# Altium project Thermostat_8CH.PrjPCB (part 3 of 6)

## Sheet TH8_TEC_driver.SchDoc: TEC
size 420 x 297 mm; Author: G.Kasprowicz; CompanyName: WUT ISE; DrawnBy: G.Kasprowicz; Organization: WUT ISE; Address1: PW ISE; Address2: Nowowiejska 15/19 00-665 Warsaw; Address3: gkasprow@gmail.com; DocumentNumber: 4; Revision: 1.0; SheetNumber: 4; SheetTotal: 9; ModifiedBy: -; CheckedDate: -; Title2: driver; DivGrp: WUT ISE; Designer: G.Kasprowicz; ModifiedDate: -; ProjectName: Sensor Box
Used 4 times, as channels U_TEC_driver0, U_TEC_driver1, U_TEC_driver2, U_TEC_driver3. Parts and nets are listed once, with the designators drawn on the sheet.
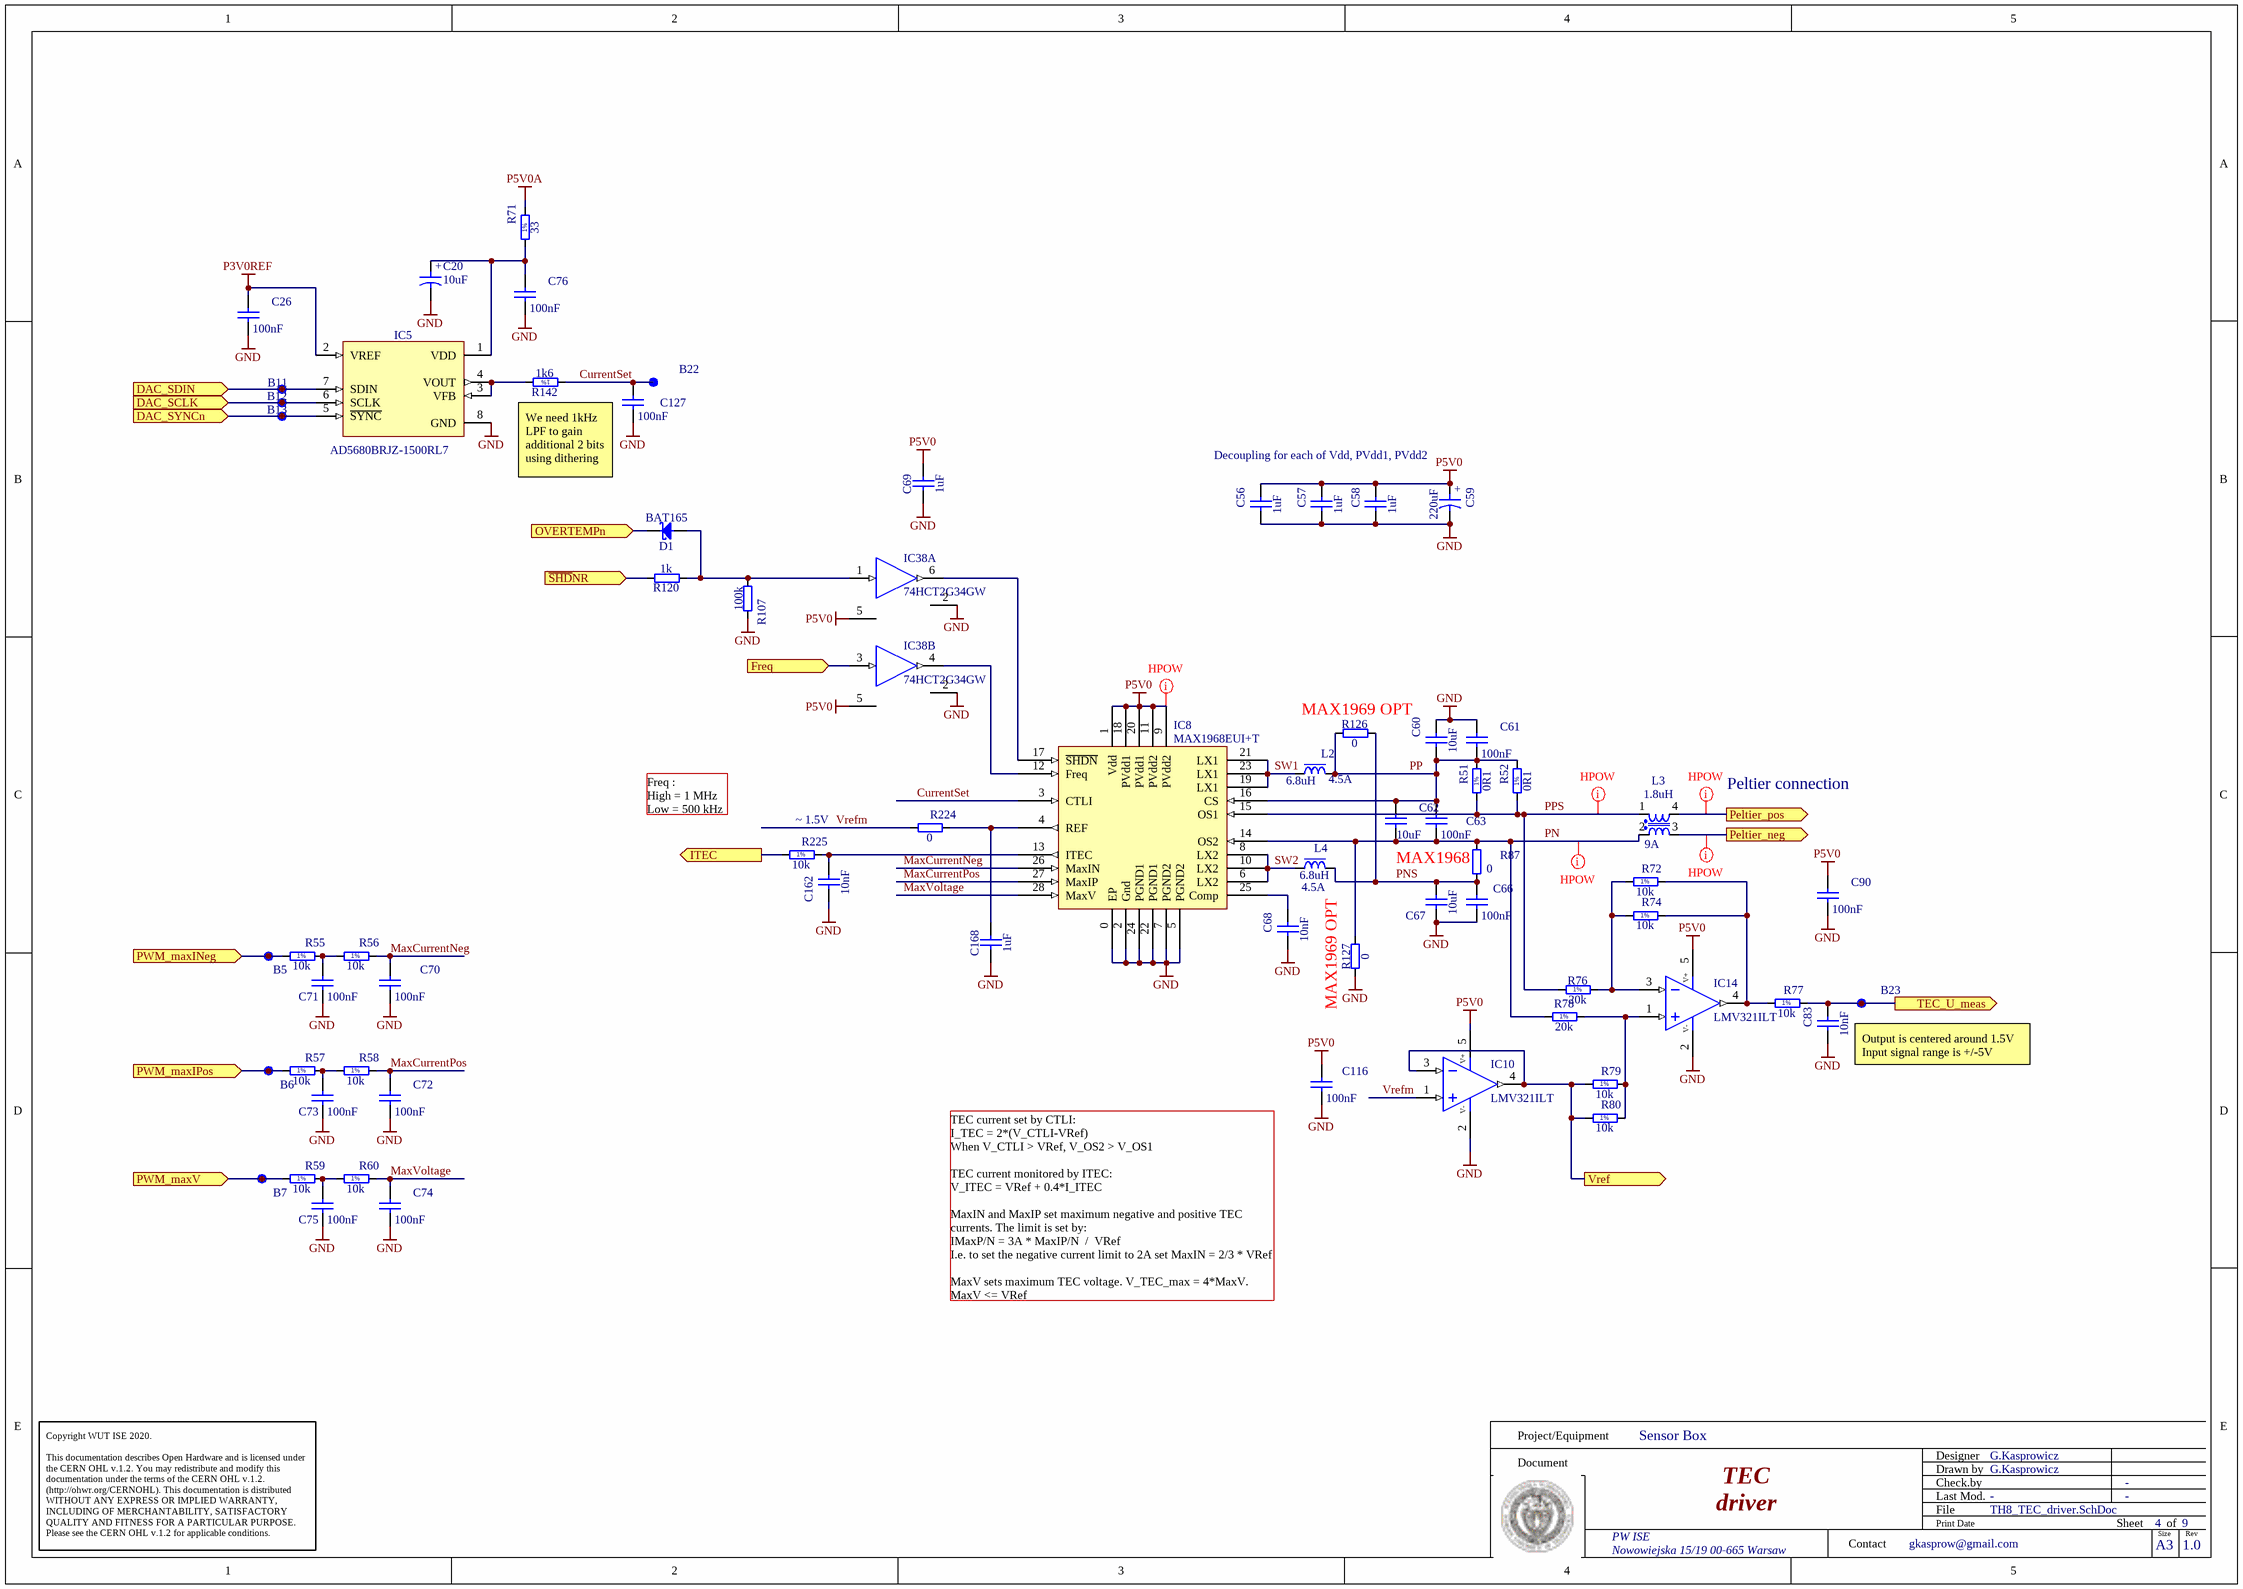
[diagram p3: TH8_TEC_driver.SchDoc]

### Parts
B5  SMD Pad  [C100]  (value not drawn)
B6  SMD Pad  [C100]  (value not drawn)
B7  SMD Pad  [C100]  (value not drawn)
B11  SMD Pad  [C100]  (value not drawn)
B12  SMD Pad  [C100]  (value not drawn)
B13  SMD Pad  [C100]  (value not drawn)
B22  SMD Pad  [C100]  (value not drawn)
B23  SMD Pad  [C100]  (value not drawn)
C20  10uF  [CAPMP3216X180N]
C26  100nF  [CAPC1005X55N]
C56  1uF  [CAPC1608X87N]
C57  1uF  [CAPC1608X87N]
C58  1uF  [CAPC1608X87N]
C59  220uF  [CAPMP7343X430N]
C60  10uF  [CAPC2012X135N]
C61  100nF  [CAPC1005X55N]
C62  10uF  [CAPC2012X135N]
C63  100nF  [CAPC1005X55N]
C66  100nF  [CAPC1005X55N]
C67  10uF  [CAPC2012X135N]
C68  10nF  [CAPC1005X55N]
C69  1uF  [CAPC1608X87N]
C70  100nF  [CAPC1005X55N]
C71  100nF  [CAPC1005X55N]
C72  100nF  [CAPC1005X55N]
C73  100nF  [CAPC1005X55N]
C74  100nF  [CAPC1005X55N]
C75  100nF  [CAPC1005X55N]
C76  100nF  [CAPC1005X55N]
C83  10nF  [CAPC1005X55N]
C90  100nF  [CAPC1005X55N]
C116  100nF  [CAPC1005X55N]
C127  100nF  [CAPC1005X55N]
C162  10nF  [CAPC1005X55N]
C168  1uF  [CAPC1608X87N]
D1  BAT165  [SOD2512X110N]
IC5  AD5680BRJZ-1500RL7  [SOT65P280X145-8N]
IC8  MAX1968EUI+T  [TSSOP28-EP]
IC10  LMV321ILT  [SOT95P280X145-5N]
IC14  LMV321ILT  [SOT95P280X145-5N]
IC38  74HCT2G34GW  [SOT65P210X110-6N]  (parts A,B of 2)
L2  6.8uH  Power: 4.5A  [INDM6965X300N]
L3  1.8uH  Power: 9A  [IND_PULSE_PA4339]
L4  6.8uH  Power: 4.5A  [INDM6965X300N]
R51  0R1  [RESC3216X65N]
R52  0R1  [RESC3216X65N]
R55  10k  [RESC1005X40N]
R56  10k  [RESC1005X40N]
R57  10k  [RESC1005X40N]
R58  10k  [RESC1005X40N]
R59  10k  [RESC1005X40N]
R60  10k  [RESC1005X40N]
R71  33  [RESC1005X40N]
R72  10k  [RESC1005X40N]
R74  10k  [RESC1005X40N]
R76  20k  [RESC1005X40N]
R77  10k  [RESC1005X40N]
R78  20k  [RESC1005X40N]
R79  10k  [RESC1005X40N]
R80  10k  [RESC1005X40N]
R87  0  [RESC3116X80N]
R107  100k  [RESC1005X40N]
R120  1k  [RESC1005X40N]
R126  0  [RESC3116X80N]
R127  0  [RESC3116X80N]
R142  1k6  [RESC1005X40N]
R224  0  [RESC1005X40N]
R225  10k  [RESC1005X40N]

### Ports
DAC_SCLK (in), DAC_SDIN (in), DAC_SYNCn (in), Freq (in), ITEC (out), OVERTEMPn (in), Peltier_neg (out), Peltier_pos (out), PWM_maxINeg (in), PWM_maxIPos (in), PWM_maxV (in), TEC_U_meas (out), Vref (out), ~{SHD}NR (in)

### Nets
GND: C20.2 C26.2 C56.1 C57.1 C58.1 C59.2 C60.2 C61.1 C66.2 C67.1 C68.1 C69.1 C70.2 C71.2 C72.2 C73.2 C74.2 C75.2 C76.2 C83.1 C90.2 C116.2 C127.2 C162.1 C168.1 IC5.8(GND) IC8.0(EP) IC8.2(Gnd) IC8.5(PGND2) IC8.7(PGND2) IC8.22(PGND1) IC8.24(PGND1) IC10.2(V-) IC14.2(V-) IC38.2(GND) R107.2 R127.1
P3V0REF: C26.1 IC5.2(VREF)
P5V0: C56.2 C57.2 C58.2 C59.1 C69.2 C90.1 C116.1 IC8.1(Vdd) IC8.9(PVdd2) IC8.11(PVdd2) IC8.18(PVdd1) IC8.20(PVdd1) IC10.5(V+) IC14.5(V+) IC38.5(VCC)
P5V0A: R71.2
~{SHD}NR: R120.2 ; port ~{SHD}NR
CurrentSet: B22.1 C127.1 IC8.3(CTLI) R142.1
DAC_SCLK: B12.1 IC5.6(SCLK) ; port DAC_SCLK
DAC_SDIN: B11.1 IC5.7(SDIN) ; port DAC_SDIN
DAC_SYNCn: B13.1 IC5.5(~{SYNC}) ; port DAC_SYNCn
Freq: IC38.3(2A) ; port Freq
ITEC: R225.1 ; port ITEC
MaxCurrentNeg: C70.1 IC8.26(MaxIN) R56.2
MaxCurrentPos: C72.1 IC8.27(MaxIP) R58.2
MaxVoltage: C74.1 IC8.28(MaxV) R60.2
OVERTEMPn: D1.1(C) ; port OVERTEMPn
Peltier_neg: L3.3 ; port Peltier_neg
Peltier_pos: L3.4 ; port Peltier_pos
PN: C62.1 C63.2 IC8.14(OS2) L3.2 R78.1 R87.2 R127.2
PNS: C66.1 C67.2 L4.2 R87.1 R126.2
PP: C60.1 C61.2 C62.2 C63.1 IC8.16(CS) L2.2 R51.2 R52.2 R126.1
PPS: IC8.15(OS1) L3.1 R51.1 R52.1 R76.1
PWM_maxINeg: B5.1 R55.1 ; port PWM_maxINeg
PWM_maxIPos: B6.1 R57.1 ; port PWM_maxIPos
PWM_maxV: B7.1 R59.1 ; port PWM_maxV
SW1: IC8.19(LX1) IC8.21(LX1) IC8.23(LX1) L2.1
SW2: IC8.6(LX2) IC8.8(LX2) IC8.10(LX2) L4.1
TEC_U_meas: B23.1 C83.2 R77.2 ; port TEC_U_meas
Vref: IC10.3(IN-) IC10.4(OUT) R79.1 R80.1 ; port Vref
Vrefm: IC10.1(IN+) R224.1
NetC20_1: C20.1 C76.1 IC5.1(VDD) R71.1
NetC68_2: C68.2 IC8.25(Comp)
NetC71_1: C71.1 R55.2 R56.1
NetC73_1: C73.1 R57.2 R58.1
NetC75_1: C75.1 R59.2 R60.1
NetC162_2: C162.2 IC8.13(ITEC) R225.2
NetC168_2: C168.2 IC8.4(REF) R224.2
NetD1_2: D1.2(A) IC38.1(1A) R107.1 R120.1
NetIC5_3: IC5.3(VFB) IC5.4(VOUT) R142.2
NetIC8_12: IC8.12(Freq) IC38.4(2Y)
NetIC8_17: IC8.17(~{SHDN}) IC38.6(1Y)
NetIC14_1: IC14.1(IN+) R78.2 R79.2 R80.2
NetIC14_3: IC14.3(IN-) R72.1 R74.1 R76.2
NetIC14_4: IC14.4(OUT) R72.2 R74.2 R77.1

### Channels
U_TEC_driver0: designators end in _1; ports DAC_SCLK=DAC_SCLK DAC_SDIN=DAC_SDIN DAC_SYNCn=DAC_SYNCn0 Freq=Freq ITEC=ITEC0 OVERTEMPn=OVERTHERMn Peltier_neg=TEC0- Peltier_pos=TEC0+ PWM_maxINeg=PWM_maxINeg0 PWM_maxIPos=PWM_maxIPos0 PWM_maxV=PWM_maxV0 TEC_U_meas=TEC_U_meas0 Vref=Vref0 ~{SHD}NR=~{SHDN}0
U_TEC_driver1: designators end in _2; ports DAC_SCLK=DAC_SCLK DAC_SDIN=DAC_SDIN DAC_SYNCn=DAC_SYNCn1 Freq=Freq ITEC=ITEC1 OVERTEMPn=OVERTHERMn Peltier_neg=TEC1- Peltier_pos=TEC1+ PWM_maxINeg=PWM_maxINeg1 PWM_maxIPos=PWM_maxIPos1 PWM_maxV=PWM_maxV1 TEC_U_meas=TEC_U_meas1 Vref=Vref1 ~{SHD}NR=~{SHDN}1
U_TEC_driver2: designators end in _3; ports DAC_SCLK=DAC_SCLK DAC_SDIN=DAC_SDIN DAC_SYNCn=DAC_SYNCn2 Freq=Freq ITEC=ITEC2 OVERTEMPn=OVERTHERMn Peltier_neg=TEC2- Peltier_pos=TEC2+ PWM_maxINeg=PWM_maxINeg2 PWM_maxIPos=PWM_maxIPos2 PWM_maxV=PWM_maxV2 TEC_U_meas=TEC_U_meas2 Vref=Vref2 ~{SHD}NR=~{SHDN}2
U_TEC_driver3: designators end in _4; ports DAC_SCLK=DAC_SCLK DAC_SDIN=DAC_SDIN DAC_SYNCn=DAC_SYNCn3 Freq=Freq ITEC=ITEC3 OVERTEMPn=OVERTHERMn Peltier_neg=TEC3- Peltier_pos=TEC3+ PWM_maxINeg=PWM_maxINeg3 PWM_maxIPos=PWM_maxIPos3 PWM_maxV=PWM_maxV3 TEC_U_meas=TEC_U_meas3 Vref=Vref3 ~{SHD}NR=~{SHDN}3

### Layout directives
net class HPOW: P5V0, PN_U_TEC_driver0, PPS_U_TEC_driver0, TEC0+, TEC0-

### Notes on the sheet
- Decoupling for each of Vdd, PVdd1, PVdd2
- We need 1kHz LPF to gain additional 2 bits using dithering
- (near R126) MAX1969 OPT
- Peltier connection
- Freq :
  High = 1 MHz
  Low = 500 kHz
- (near R225) ~ 1.5V
- MAX1968
- (near R127) MAX1969 OPT
- Output is centered around 1.5V
  Input signal range is +/-5V
- (near C116) TEC current set by CTLI:
  I_TEC = 2*(V_CTLI-VRef)
  When V_CTLI > VRef, V_OS2 > V_OS1
  TEC current monitored by ITEC:
  V_ITEC = VRef + 0.4*I_ITEC
  MaxIN and MaxIP set maximum negative and positive TEC currents. The limit is set by:
  IMaxP/N = 3A * MaxIP/N  /  VRef
  I.e. to set the negative current limit to 2A set MaxIN = 2/3 * VRef
  MaxV sets maximum TEC voltage. V_TEC_max = 4*MaxV. MaxV <= VRef
- Project/Equipment
- Document
- Designer
- Drawn by
- Check.by
- Copyright WUT ISE 2020.
  This documentation describes Open Hardware and is licensed under the CERN OHL v.1.2. You may redistribute and modify this documentation under the terms of the CERN OHL v.1.2. (http://ohwr.org/CERNOHL). This documentation is distributed WITHOUT ANY EXPRESS OR IMPLIED WARRANTY, INCLUDING OF MERCHANTABILITY, SATISFACTORY QUALITY AND FITNESS FOR A PARTICULAR PURPOSE. Please see the CERN OHL v.1.2 for applicable conditions.
- Contact
- File
- Last Mod.
- Print Date
- Sheet
- Size
- A3
- of
- Rev
- (in symbol CTE3216-18_10UF_16V_20%_AVX_TCJ) +
- (in symbol CTE7343-43_220UF_16V_10%) +
- (in symbol R0402_1K6_1%_0.0625W_100PPM) 1%
- (in symbol R0402_10K_1%_0.0625W_100PPM) 1%
- (in symbol R0402_20K_1%_0.0625W_100PPM) 1%
- (in symbol R0402_33R_1%_0.0625W_100PPM) 1%
- (in symbol R1206_0R1_1%_0.25W_100PPM_YAGEO_PT) 1%

### Library data of the parts
B5-B7 B11-B13 B22 B23 = SMD_PAD_D1MM: as B14 on sheet TH8_CPU_STM32F4; Part Number: SMD_PAD_D1MM; Component Kind: Standard (No BOM); Component Type: Standard (No BOM); Pin Count: 1; Family: SMD Pad; Socket: No; SMD: No; Sense: No; Status: None; ComponentHeight: 0mm; HelpURL: Undefined; Author: CERN DEM JLC; CreateDate: 10.10.2017; LatestRevisionDate: 10.10.2017; PackageDescription: 1mm Diameter SMD Pad
C20 = CTE3216-18_10UF_16V_20%_AVX_TCJ: Polarised capacitor; Part Description: ESR 0R200 Tantalum Solid Electrolytic Chip Capacitor with Conductive Polymer Electrode; Manufacturer: AVX; Manufacturer Part Number: TCJA106M016R0200; Voltage: 16V; Tolerance: ±20%; Part Number: CTE3216-18_10UF_16V_20%_AVX_TCJ; Component Kind: Standard; Component Type: Standard; Pin Count: 2; Value: 10uF; Status: Preferred; Case: A; Mounted: Yes; Socket: No; SMD: Yes; Sense: No; ComponentHeight: 1.8mm; HelpURL: \\cern.ch\dfs\Applications\Altium\Datasheets\CTE_AVX_TCJ.pdf; Author: CERN DEM JLC; CreateDate: 29.03.2012; LatestRevisionDate: 29.03.2012
C26 C61 C63 C66 C70-C76 C90 C116 C127 = CC0402_100NF_16V_10%_X5R: Non-polarised capacitor; Part Description: SMD Multilayer Chip Ceramic Capacitor; Manufacturer: GENERIC; Manufacturer1 Part Number: GRM155R61C104KA88D; Voltage: 16V; TC: X5R; Tolerance: ±10%; Table: Capacitors SMD; Part Number: CC0402_100NF_16V_10%_X5R; Component Kind: Standard; Component Type: Standard; Pin Count: 2; Value: 100nF; Status: None; Manufacturer Part Number: CC0402_100NF_16V_10%_X5R; Case: 0402; Mounted: Yes; Socket: No; SMD: Yes; Manufacturer1 Example: MURATA; Manufacturer1 ComponentHeight: 0.55mm; HelpURL: \\cern.ch\dfs\Applications\Altium\Datasheets\CC0402_X5R_MURATA_GRM.pdf; Author: CERN DEM JLC; CreateDate: 2013-12-10; LatestRevisionDate: 2013-12-10
C56-C58 C69 C168 = CC0603_1UF_25V_10%_X7R: Non-polarised capacitor; Part Description: SMD Multilayer Chip Ceramic Capacitor; Manufacturer: GENERIC; Manufacturer1 Part Number: GRM188R71E105KA12D; Voltage: 25V; TC: X7R; Tolerance: ±10%; Part Number: CC0603_1UF_25V_10%_X7R; Component Kind: Standard; Component Type: Standard; Pin Count: 2; Value: 1uF; Status: None; Manufacturer Part Number: CC0603_1UF_25V_10%_X7R; Case: 0603; Mounted: Yes; Socket: No; SMD: Yes; Sense: No; Manufacturer1 Example: MURATA; Manufacturer1 ComponentHeight: 0.9mm; HelpURL: \\cern.ch\dfs\Applications\Altium\Datasheets\CC0603_X7R_MURATA.pdf; Author: CERN DEM JLC; CreateDate: 18/01/2011; LatestRevisionDate: 18/01/2011
C59 = CTE7343-43_220UF_16V_10%: Polarised capacitor; Part Description: Solid Tantalum Chip Capacitor; Manufacturer: GENERIC; Manufacturer1 Part Number: TAJE227K016R; Voltage: 16V; Tolerance: ±10%; Part Number: CTE7343-43_220UF_16V_10%; Component Kind: Standard; Component Type: Standard; Pin Count: 2; Value: 220uF; Status: Preferred; Manufacturer Part Number: CTE7343-43_220UF_16V_10%; Case: E; Mounted: Yes; Socket: No; SMD: Yes; Sense: No; Manufacturer1 Example: AVX; Manufacturer1 ComponentHeight: 4.3mm; HelpURL: \\cern.ch\dfs\Applications\Altium\Datasheets\CTE_AVX_TAJ.pdf; Author: CERN DEM JLC; CreateDate: 03.12.2007; LatestRevisionDate: 03.12.2007
C60 C62 C67 = CC0805_10UF_16V_10%_X5R: Non-polarised capacitor; Part Description: SMD Multilayer Chip Ceramic Capacitor; Manufacturer: GENERIC; Manufacturer1 Part Number: C0805C106K4PAC; Voltage: 16V; TC: X5R; Tolerance: ±10%; Part Number: CC0805_10UF_16V_10%_X5R; Component Kind: Standard; Component Type: Standard; Pin Count: 2; Value: 10uF; Status: Preferred; Manufacturer Part Number: CC0805_10UF_16V_10%_X5R; Case: 0805; Mounted: Yes; Socket: No; SMD: Yes; Manufacturer1 Example: KEMET; Manufacturer1 ComponentHeight: 1.4mm; HelpURL: \\cern.ch\dfs\Applications\Altium\Datasheets\CC1206_X5R_KEMET.pdf; Author: CERN DEM JLC; CreateDate: 03.12.2007; LatestRevisionDate: 03.12.2007; Sense: No
C68 C83 C162 = CC0402_10NF_25V_10%_X7R: Non-polarised capacitor; Part Description: SMD Multilayer Chip Ceramic Capacitor; Manufacturer: GENERIC; Manufacturer1 Part Number: C1005X7R1E103KT; Voltage: 25V; TC: X7R; Tolerance: ±10%; Part Number: CC0402_10NF_25V_10%_X7R; Component Kind: Standard; Component Type: Standard; Pin Count: 2; Value: 10nF; Status: Preferred; Manufacturer Part Number: CC0402_10NF_25V_10%_X7R; Case: 0402; Mounted: Yes; Socket: No; SMD: Yes; Sense: No; Manufacturer1 Example: TDK; Manufacturer1 ComponentHeight: 0.55mm; HelpURL: \\cern.ch\dfs\Applications\Altium\Datasheets\CC0402_X7R_TDK_C.pdf; Author: CERN DEM JLC; CreateDate: 25/10/2012; LatestRevisionDate: 25/10/2012
D1 = BAT165: Schottky Diode; Part Description: Medium Power AF Schottky Diode; Manufacturer: INFINEON; Voltage: 40V; Power: 750mA; PressFit: No; Bonding: No; Part Number: BAT165; Component Kind: Standard; Component Type: Standard; Device: BAT165; PackageDescription: Small Outline Diode Flat Lead (SOD-323), 1.70mm W X 1.25mm L X 1.10mm H body,  IPC Medium Density; Manufacturer Part Number: BAT165; Pin Count: 2; Case: SOD323; Mounted: Yes; Socket: No; SMD: Yes; Sense: No; ComponentHeight: 1.1mm; HelpURL: \\cern.ch\dfs\Applications\Altium\Datasheets\BAT165.pdf; Author: CERN DEM JLC; CreateDate: 12.11.2014; LatestRevisionDate: 12.11.2014
IC5 = DAC_AD5680BRJZ: 5V 18-Bit nanoDAC®in a SOT-23; Manufacturer: ANALOG DEVICES; PressFit: No; Bonding: No; Part Number: AD5680BRJZ-1500RL7; Component Kind: Standard; Component Type: Standard; Device: AD5680BRJZ-1500RL7; Footprint: TSOP65P280X145-8N; PackageDescription: TSOP, 8-Leads, Body 2,90x1,60mm, Pitch 0,65mm, IPC Medium Density; Part Description: 5V 18-Bit nanoDAC®in a SOT-23; Manufacturer Part Number: AD5680BRJZ-1500RL7; Pin Count: 17; Case: SOT-23-8; Mounted: Yes; Socket: No; SMD: Yes; Sense: No; ComponentHeight: 0.8mm; Author: GK; HelpURL: \\cern.ch\dfs\Applications\Altium\Datasheets\AD5686BCPZ.pdf; CreateDate: 21.08.2017; LatestRevisionDate: 21.08.2017
IC8 = DRV_MAX1968: Power peltier driver. bipolar; LatestRevisionDate: 17-Jul-2002; LatestRevisionNote: Re-released for DXP Platform.; Publisher: Altium Limited; Supplier 1: RS; Supplier Part Number 1: 7328863; Supplier Currency 1: GBP; Supplier Unit Price 1: 14.75
IC10 IC14 = LMV321ILT: Operational Amplifier; Part Description: Low Cost, Low Power, Input/Output Rail-To-Rail Operational Amplifiers; Manufacturer: ST MICROELECTRONICS; PressFit: No; Bonding: No; Part Number: LMV321ILT; Component Kind: Standard; Component Type: Standard; Device: LMV321ILT; PackageDescription: SOT, 0.95mm pitch; 5 pin, 1.60mm W X 2.90mm L X 1.45mm H body, IPC Medium Density; Manufacturer Part Number: LMV321ILT; Pin Count: 5; Case: SOT23-5; Mounted: Yes; Socket: No; SMD: Yes; Sense: No; ComponentHeight: 1.45mm; Author: CERN DEM MR; HelpURL: \\cern.ch\dfs\Applications\Altium\Datasheets\LMV321ILT.pdf; CreateDate: 02.10.2017; LatestRevisionDate: 02.10.2017
IC38 = 74HCT2G34GW: Dual Buffer Gate; Manufacturer: TEXAS INSTRUMENTS; PressFit: No; Bonding: No; Part Number: 74HCT2G34GW; Component Kind: Standard; Component Type: Standard; Device: 74HCT2G34GW; PackageDescription: SOT, 0.65mm Pitch; 6 Pin, 1.60mm W X 3.00mm L X 1.45mm H body, IPC Medium Density; Part Description: Dual Buffer Gate; Manufacturer Part Number: 74HCT2G34GW; Pin Count: 6; Case: SOT353; Mounted: Yes; Socket: No; SMD: Yes; Sense: No; ComponentHeight: 1.45mm; Author: GK; HelpURL: \\cern.ch\dfs\Applications\Altium\Datasheets\SN74LVC2G34DBV.pdf; CreateDate: 09.10.2020; LatestRevisionDate: 09.10.2020
L2 L4 = IND2525_6.8UH_20%_VISHAY_IHLP-2525CZ-01: Inductor With Core; Part Description: Low Profile, High Current IHLP® Inductor; Manufacturer: VISHAY DALE; Manufacturer Part Number: IHLP2525CZER6R8M01; Resistance: 0.054R; Tolerance: ±20%; Part Number: IND2525_6.8UH_20%_VISHAY_IHLP-2525CZ-01; Component Kind: Standard; Component Type: Standard; Pin Count: 2; Value: 6.8uH; Status: None; Case: 2525; Mounted: Yes; Socket: No; SMD: Yes; Sense: No; ComponentHeight: 3mm; HelpURL: \\cern.ch\dfs\Applications\Altium\Datasheets\IND2525_VISHAY_IHLP-2525CZ-01.pdf; Author: CERN DEM MR; CreateDate: 29/06/2017; LatestRevisionDate: 29/06/2017
L3 = L_CMC_PA4339.101NLT: 1.8uH 9A 10mR CMC; Part Description: Line Filter, Common Mode Choke; Manufacturer: PULSE; Resistance: 0.010R; Tolerance: ±50%; Part Number: PA4339.101NLT; Component Kind: Standard; Component Type: Standard; Pin Count: 4; Value: 1.8uH; Status: None; Manufacturer Part Number: PA4339.101NLT; Mounted: Yes; Socket: No; SMD: Yes; Sense: No; ComponentHeight: 3.8; HelpURL: \\cern.ch\dfs\Applications\Altium\Datasheets\IND_BOURNS_SRF0504.pdf; Author: GK; CreateDate: 07/08/2017; LatestRevisionDate: 07/08/2017
R51 R52 = R1206_0R1_1%_0.25W_100PPM_YAGEO_PT: Resistor - 1%; Part Description: Current Sensor, Low TCR Chip Resistor; Manufacturer: YAGEO PHYCOMP; Manufacturer Part Number: PT1206FR-070R1L; Power: 0.25W; TC: ±100ppm/°C; PressFit: No; Part Number: R1206_0R1_1%_0.25W_100PPM_YAGEO_PT; Component Kind: Standard; Component Type: Standard; Pin Count: 2; Value: 0R1; Status: None; Tolerance: ±1%; Case: 1206; Mounted: Yes; Sense: No; Socket: No; SMD: Yes; ComponentHeight: 0.65mm; HelpURL: \\cern.ch\dfs\Applications\Altium\Datasheets\R1206_YAGEO_PT.pdf; Author: CERN DEM JMW; CreateDate: 06/07/2015; LatestRevisionDate: 06/07/2015
R55-R60 R72 R74 R77 R79 R80 R225 = R0402_10K_1%_0.0625W_100PPM: Resistor - 1%; Part Description: General Purpose Thick Film Chip Resistor; Manufacturer: GENERIC; Manufacturer1 Part Number: 232270671003L; TC: ±100ppm/°C; PressFit: No; Part Number: R0402_10K_1%_0.0625W_100PPM; Component Kind: Standard; Component Type: Standard; Pin Count: 2; Value: 10k; Status: Not Recommended; Power: 0.0625W; Tolerance: ±1%; Manufacturer Part Number: R0402_10K_1%_0.0625W_100PPM; Case: 0402; Mounted: Yes; Sense: No; Socket: No; SMD: Yes; Manufacturer1 Example: YAGEO PHYCOMP; Manufacturer1 ComponentHeight: 0.4mm; HelpURL: \\cern.ch\dfs\Applications\Altium\Datasheets\R0402_Phycomp_RC0402.pdf; Author: CERN DEM JLC; CreateDate: 03/12/2007; LatestRevisionDate: 17/10/2012
R71 = R0402_33R_1%_0.0625W_100PPM: as R70 on sheet TH8_CPU_STM32F4; Part Number: R0402_33R_1%_0.0625W_100PPM; Component Kind: Standard; Component Type: Standard; Pin Count: 2; Value: 33; Status: Not Recommended; Power: 0.0625W; Tolerance: ±1%; Manufacturer Part Number: R0402_33R_1%_0.0625W_100PPM; Case: 0402; Mounted: Yes; Sense: No; Socket: No; SMD: Yes; Manufacturer1 Example: YAGEO PHYCOMP; Manufacturer1 ComponentHeight: 0.4mm; HelpURL: \\cern.ch\dfs\Applications\Altium\Datasheets\R0402_Phycomp_RC0402.pdf; Author: CERN DEM JLC; CreateDate: 03/12/2007; LatestRevisionDate: 17/10/2012
R76 R78 = R0402_20K_1%_0.0625W_100PPM: Resistor - 1%; Part Description: General Purpose Thick Film Chip Resistor; Manufacturer: GENERIC; Manufacturer1 Part Number: 232270672003L; TC: ±100ppm/°C; PressFit: No; Part Number: R0402_20K_1%_0.0625W_100PPM; Component Kind: Standard; Component Type: Standard; Pin Count: 2; Value: 20k; Status: Not Recommended; Power: 0.0625W; Tolerance: ±1%; Manufacturer Part Number: R0402_20K_1%_0.0625W_100PPM; Case: 0402; Mounted: Yes; Sense: No; Socket: No; SMD: Yes; Manufacturer1 Example: YAGEO PHYCOMP; Manufacturer1 ComponentHeight: 0.4mm; HelpURL: \\cern.ch\dfs\Applications\Altium\Datasheets\R0402_Phycomp_RC0402.pdf; Author: CERN DEM JLC; CreateDate: 03.12.2007; LatestRevisionDate: 17.10.2012
R87 R126 R127 = R1206_0R_JUMPER_SEI_HCJ: Resistor; Part Description: 38.7A (0.0005R Max DC Resistance) Zero Ohm Jumper; Manufacturer: SEI (STACKPOLE ELECTRONICS INC.); Manufacturer Part Number: HCJ1206ZT0R00; PressFit: No; Part Number: R1206_0R_JUMPER_SEI_HCJ; Component Kind: Standard; Component Type: Standard; Pin Count: 2; Value: 0; Status: Not Recommended; Case: 1206; Mounted: Yes; Sense: No; Socket: No; SMD: Yes; HelpURL: \\cern.ch\dfs\Applications\Altium\Datasheets\R1206_SEI_HCJ.pdf; Author: CERN DEM MR; CreateDate: 20.02.2018; LatestRevisionDate: 20.02.2018; ComponentHeight: 0.8mm
R107 = R0402_100K_1%_0.0625W_100PPM: Resistor - 1%; Part Description: General Purpose Thick Film Chip Resistor; Manufacturer: GENERIC; Manufacturer1 Part Number: 232270671004L; TC: ±100ppm/°C; PressFit: No; Part Number: R0402_100K_1%_0.0625W_100PPM; Component Kind: Standard; Component Type: Standard; Pin Count: 2; Value: 100k; Status: Not Recommended; Power: 0.0625W; Tolerance: ±1%; Manufacturer Part Number: R0402_100K_1%_0.0625W_100PPM; Case: 0402; Mounted: Yes; Sense: No; Socket: No; SMD: Yes; Manufacturer1 Example: YAGEO PHYCOMP; Manufacturer1 ComponentHeight: 0.4mm; HelpURL: \\cern.ch\dfs\Applications\Altium\Datasheets\R0402_Phycomp_RC0402.pdf; Author: CERN DEM JLC; CreateDate: 03.12.2007; LatestRevisionDate: 17.10.2012
R120 = R0402_1K_1%_0.0625W_100PPM: Resistor - 1%; Part Description: General Purpose Thick Film Chip Resistor; Manufacturer: GENERIC; Manufacturer1 Part Number: 232270671002L; TC: ±100ppm/°C; PressFit: No; Part Number: R0402_1K_1%_0.0625W_100PPM; Component Kind: Standard; Component Type: Standard; Pin Count: 2; Value: 1k; Status: Not Recommended; Power: 0.0625W; Tolerance: ±1%; Manufacturer Part Number: R0402_1K_1%_0.0625W_100PPM; Case: 0402; Mounted: Yes; Sense: No; Socket: No; SMD: Yes; Manufacturer1 Example: YAGEO PHYCOMP; Manufacturer1 ComponentHeight: 0.4mm; HelpURL: \\cern.ch\dfs\Applications\Altium\Datasheets\R0402_Phycomp_RC0402.pdf; Author: CERN DEM JLC; CreateDate: 03.12.2007; LatestRevisionDate: 17.10.2012
R142 = R0402_1K6_1%_0.0625W_100PPM: Resistor - 1%; Part Description: General Purpose Thick Film Chip Resistor; Manufacturer: GENERIC; Manufacturer1 Part Number: 232270671602L; TC: ±100ppm/°C; PressFit: No; Part Number: R0402_1K6_1%_0.0625W_100PPM; Component Kind: Standard; Component Type: Standard; Pin Count: 2; Value: 1k6; Status: Not Recommended; Power: 0.0625W; Tolerance: ±1%; Manufacturer Part Number: R0402_1K6_1%_0.0625W_100PPM; Case: 0402; Mounted: Yes; Sense: No; Socket: No; SMD: Yes; Manufacturer1 Example: YAGEO PHYCOMP; Manufacturer1 ComponentHeight: 0.4mm; HelpURL: \\cern.ch\dfs\Applications\Altium\Datasheets\R0402_Phycomp_RC0402.pdf; Author: CERN DEM JLC; CreateDate: 03.12.2007; LatestRevisionDate: 17.10.2012
R224 = R0402_0R_Jumper: Resistor; Part Description: 1A (0.05R Max DC Resistance) Zero Ohm Jumper; Manufacturer: GENERIC; Manufacturer1 Part Number: 232270591001L; PressFit: No; Part Number: R0402_0R_JUMPER; Component Kind: Standard; Component Type: Standard; Pin Count: 2; Value: 0; Status: Not Recommended; Manufacturer Part Number: R0402_0R_JUMPER; Case: 0402; Mounted: Yes; Sense: No; Socket: No; SMD: Yes; Manufacturer1 Example: YAGEO PHYCOMP; Manufacturer1 ComponentHeight: 0.4mm; HelpURL: \\cern.ch\dfs\Applications\Altium\Datasheets\R0402_Phycomp_RC0402.pdf; Author: CERN DEM JLC; CreateDate: 03.12.2007; LatestRevisionDate: 17.10.2012

## Sheet TH8_RMII_Ethernet.SchDoc: Thermostat 8CH
size 420 x 297 mm; Author: G.Kasprowicz; CompanyName: WUT ISE; DrawnBy: G.Kasprowicz; Organization: WUT ISE; Address1: PW ISE; Address2: Nowowiejska 15/19 00-665 Warsaw; Address3: gkasprow@gmail.com; DocumentNumber: 8; Revision: 1.0; SheetNumber: 8; SheetTotal: 9; ModifiedBy: -; CheckedDate: -; Title2: Ethernet; DivGrp: WUT ISE; Designer: G.Kasprowicz; ModifiedDate: -; ProjectName: Sensor Box
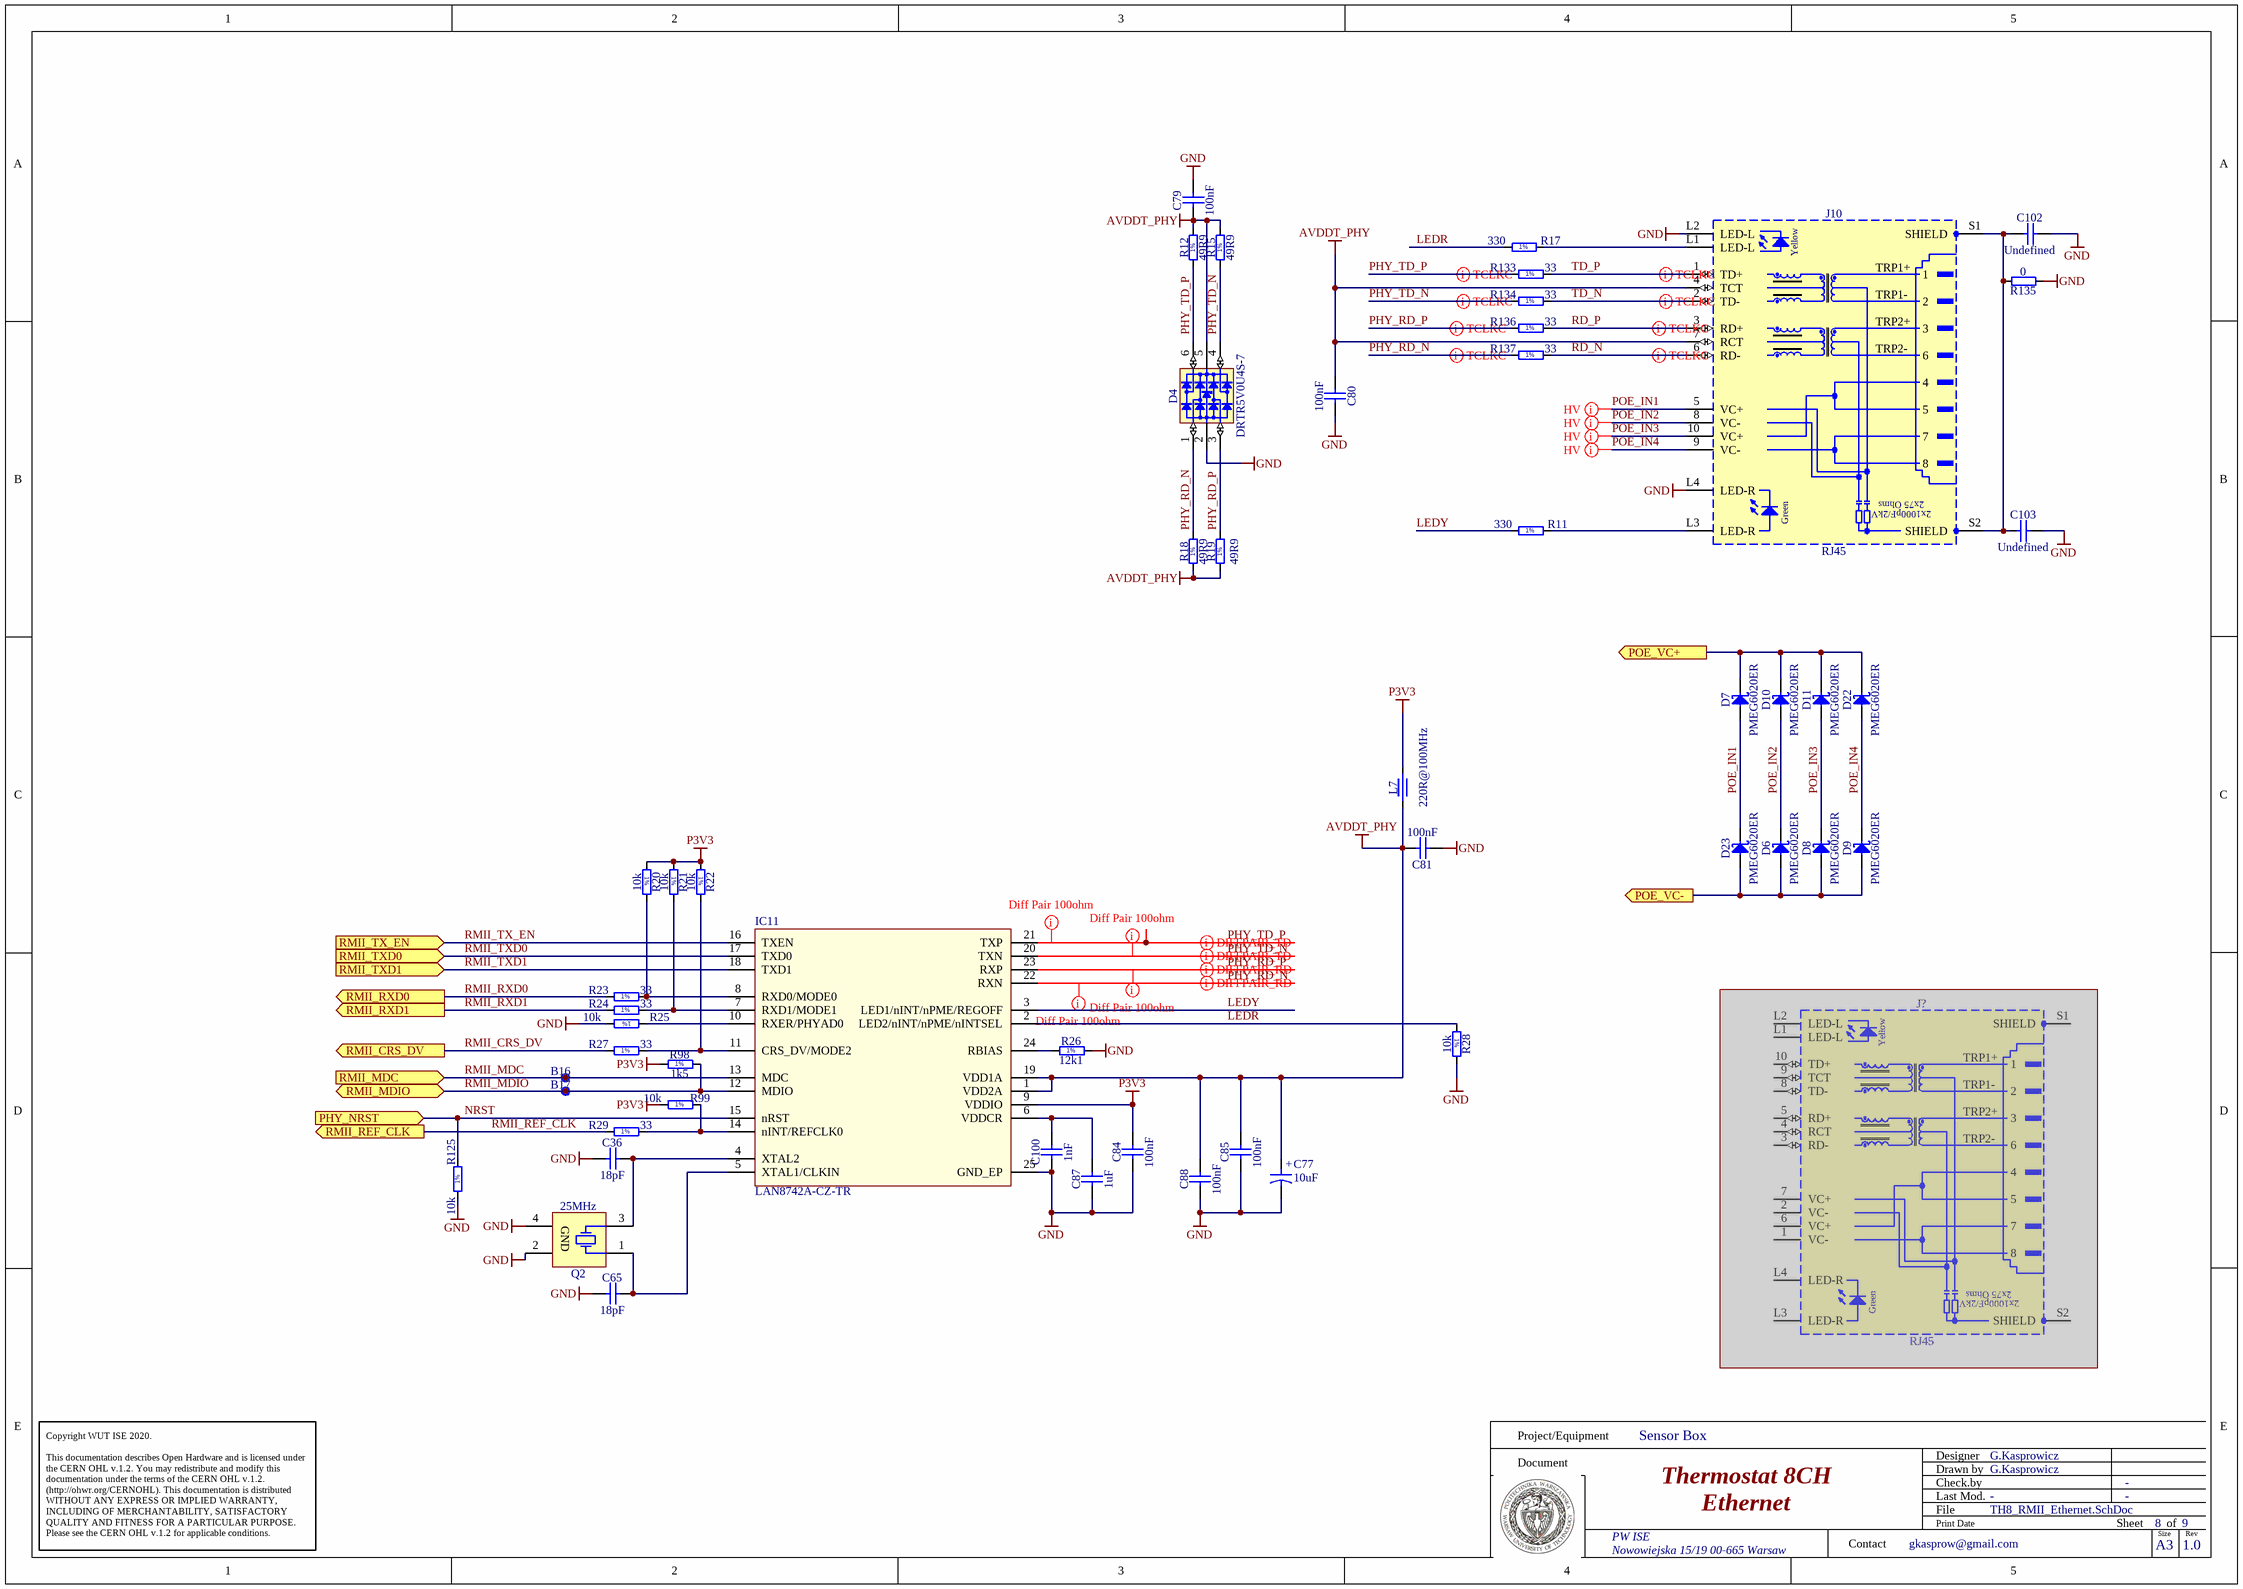
[diagram p4: TH8_RMII_Ethernet.SchDoc]

### Parts
B16  SMD Pad  [C100]  (value not drawn)
B17  SMD Pad  [C100]  (value not drawn)
C36  18pF  [CAPC1005X55N]
C65  18pF  [CAPC1005X55N]
C77  10uF  [CAPMP3216X180N]
C79  100nF  [CAPC1005X55N]
C80  100nF  [CAPC1005X55N]
C81  100nF  [CAPC1005X55N]
C84  100nF  [CAPC1005X55N]
C85  100nF  [CAPC1005X55N]
C87  1uF  [CAPC1608X87N]
C88  100nF  [CAPC1005X55N]
C100  1nF  [CAPC1005X55N]
C102  Undefined  [CAPC2012X135N]
C103  Undefined  [CAPC2012X135N]
D4  DRTR5V0U4S-7  [SOT65P210X110-6N]
D6  PMEG6020ER  [SODFL3517X110N]
D7  PMEG6020ER  [SODFL3517X110N]
D8  PMEG6020ER  [SODFL3517X110N]
D9  PMEG6020ER  [SODFL3517X110N]
D10  PMEG6020ER  [SODFL3517X110N]
D11  PMEG6020ER  [SODFL3517X110N]
D22  PMEG6020ER  [SODFL3517X110N]
D23  PMEG6020ER  [SODFL3517X110N]
IC11  LAN8742A-CZ-TR  [QFN24_0R5_4X4]
J10  RJ45  [ABRACON_ARJM11C7-114-BA-EW2]
J?  RJ45  [ABRACON_ARJM11C7-114-BA-EW2]  (masked out: inside a compile mask, not in the netlist)
L7  220R@100MHz  [INDC1005X55N]
Q2  25MHz  [XTAL_EPSON_TSX-3225]
R11  330  [RESC1005X40N]
R12  49R9  [RESC1005X40N]
R15  49R9  [RESC1005X40N]
R17  330  [RESC1005X40N]
R18  49R9  [RESC1005X40N]
R19  49R9  [RESC1005X40N]
R20  10k  [RESC1005X40N]
R21  10k  [RESC1005X40N]
R22  10k  [RESC1005X40N]
R23  33  [RESC1005X40N]
R24  33  [RESC1005X40N]
R25  10k  [RESC1005X40N]
R26  12k1  [RESC1005X40N]
R27  33  [RESC1005X40N]
R28  10k  [RESC1005X40N]
R29  33  [RESC1005X40N]
R98  1k5  [RESC1005X40N]
R99  10k  [RESC1005X40N]
R125  10k  [RESC1005X40N]
R133  33  [RESC1005X40N]
R134  33  [RESC1005X40N]
R135  0  [RESC1608X55N]
R136  33  [RESC1005X40N]
R137  33  [RESC1005X40N]

### Ports
PHY_NRST (in), POE_VC+ (out), POE_VC- (out), RMII_CRS_DV (out), RMII_MDC (in), RMII_MDIO (bidir), RMII_REF_CLK (out), RMII_RXD0 (out), RMII_RXD1 (out), RMII_TX_EN (in), RMII_TXD0 (in), RMII_TXD1 (in)

### Nets
AVDDT_PHY: C77.1 C79.1 C80.2 C81.2 C85.2 C88.2 D4.5(VBUS) IC11.1(VDD2A) IC11.19(VDD1A) J10.4(TCT) J10.7(RCT) L7.1 R12.2 R15.2 R18.1 R19.1
GND: C36.1 C65.1 C77.2 C79.2 C80.1 C81.1 C84.1 C85.1 C87.1 C88.1 C100.1 C102.2 C103.2 D4.2(GND) IC11.25(GND_EP) J10.L2(LED-L) J10.L4(LED-R) Q2.2(GND) Q2.4(GND) R25.2 R26.2 R28.2 R125.1 R135.1
P3V3: C84.2 IC11.9(VDDIO) L7.2 R20.1 R21.1 R22.1 R98.1 R99.1
LEDR: IC11.2(LED2/nINT/nPME/nINTSEL) R17.1 R28.1
LEDY: IC11.3(LED1/nINT/nPME/REGOFF) R11.1
NRST: IC11.15(nRST) R125.2 ; port PHY_NRST
PHY_RD_N: D4.1(I/O1) IC11.22(RXN) R18.2 R137.1
PHY_RD_P: D4.3(I/O2) IC11.23(RXP) R19.2 R136.1
PHY_TD_N: D4.4(I/O3) IC11.20(TXN) R15.1 R134.1
PHY_TD_P: D4.6(I/O4) IC11.21(TXP) R12.1 R133.1
POE_IN1: D7.2(A) D23.1(C) J10.5(VC+)
POE_IN2: D6.1(C) D10.2(A) J10.8(VC-)
POE_IN3: D8.1(C) D11.2(A) J10.10(VC+)
POE_IN4: D9.1(C) D22.2(A) J10.9(VC-)
POE_VC+: D7.1(C) D10.1(C) D11.1(C) D22.1(C) ; port POE_VC+
POE_VC-: D6.2(A) D8.2(A) D9.2(A) D23.2(A) ; port POE_VC-
RD_N: J10.6(RD-) R137.2
RD_P: J10.3(RD+) R136.2
RMII_CRS_DV: R27.1 ; port RMII_CRS_DV
RMII_MDC: B16.1 IC11.13(MDC) ; port RMII_MDC
RMII_MDIO: B17.1 IC11.12(MDIO) R98.2 ; port RMII_MDIO
RMII_REF_CLK: R29.1 ; port RMII_REF_CLK
RMII_RXD0: R23.1 ; port RMII_RXD0
RMII_RXD1: R24.1 ; port RMII_RXD1
RMII_TX_EN: IC11.16(TXEN) ; port RMII_TX_EN
RMII_TXD0: IC11.17(TXD0) ; port RMII_TXD0
RMII_TXD1: IC11.18(TXD1) ; port RMII_TXD1
TD_N: J10.2(TD-) R134.2
TD_P: J10.1(TD+) R133.2
NetC36_2: C36.2 IC11.4(XTAL2) Q2.3(X)
NetC65_2: C65.2 IC11.5(XTAL1/CLKIN) Q2.1(X)
NetC87_2: C87.2 C100.2 IC11.6(VDDCR)
NetC102_1: C102.1 C103.1 J10.S1(SHIELD) J10.S2(SHIELD) R135.2
NetIC11_7: IC11.7(RXD1/MODE1) R21.2 R24.2
NetIC11_8: IC11.8(RXD0/MODE0) R20.2 R23.2
NetIC11_10: IC11.10(RXER/PHYAD0) R25.1
NetIC11_11: IC11.11(CRS_DV/MODE2) R22.2 R27.2
NetIC11_14: IC11.14(nINT/REFCLK0) R29.2 R99.2
NetIC11_24: IC11.24(RBIAS) R26.1
NetJ10_L1: J10.L1(LED-L) R17.2
NetJ10_L3: J10.L3(LED-R) R11.2

### Layout directives
differential pair: PHY_RD_N, PHY_RD_P, PHY_TD_N, PHY_TD_P, RD_N, RD_P, TD_N, TD_P
rule Matched Net Lengths [Tolerance = 100mil]: PHY_RD_N, PHY_RD_P, PHY_TD_N, PHY_TD_P
net class HV: POE_IN1, POE_IN2, POE_IN3, POE_IN4

### Notes on the sheet
- Project/Equipment
- Document
- Designer
- Drawn by
- Check.by
- Copyright WUT ISE 2020.
  This documentation describes Open Hardware and is licensed under the CERN OHL v.1.2. You may redistribute and modify this documentation under the terms of the CERN OHL v.1.2. (http://ohwr.org/CERNOHL). This documentation is distributed WITHOUT ANY EXPRESS OR IMPLIED WARRANTY, INCLUDING OF MERCHANTABILITY, SATISFACTORY QUALITY AND FITNESS FOR A PARTICULAR PURPOSE. Please see the CERN OHL v.1.2 for applicable conditions.
- Contact
- File
- Last Mod.
- Print Date
- Sheet
- Size
- A3
- of
- Rev
- (in symbol CON_ETH_POE_ARJM11C7) Yellow; TRP1+; TRP1-; TRP2+; TRP2-; 2x75 Ohms; Green; 2x1000pF/2kV
- (in symbol CTE3216-18_10UF_16V_20%_AVX_TCJ) +
- (in symbol R0402_1K5_1%_0.0625W_100PPM) 1%
- (in symbol R0402_10K_1%_0.0625W_100PPM) 1%
- (in symbol R0402_12K1_1%_0.0625W_100PPM) 1%
- (in symbol R0402_33R_1%_0.0625W_100PPM) 1%
- (in symbol R0402_49R9_1%_0.0625W_100PPM) 1%
- (in symbol R0402_330R_1%_0.0625W_100PPM) 1%

### Library data of the parts
B16 B17 = SMD_PAD_D1MM: Through Hole Pad; Part Description: 1mm Diameter SMD Pad; Mounted: No; Part Number: SMD_PAD_D1MM; Component Kind: Standard (No BOM); Component Type: Standard (No BOM); Pin Count: 1; Family: SMD Pad; Socket: No; SMD: No; Sense: No; Status: None; ComponentHeight: 0mm; HelpURL: Undefined; Author: CERN DEM JLC; CreateDate: 10.10.2017; LatestRevisionDate: 10.10.2017; PackageDescription: 1mm Diameter SMD Pad
C36 C65 = CC0402_18PF_50V_5%_C0G: Non-polarised capacitor; Part Description: SMD Multilayer Chip Ceramic Capacitor; Manufacturer: GENERIC; Manufacturer1 Part Number: C0402C180J5GACTU; Voltage: 50V; TC: C0G/NP0; Tolerance: ±5%; Part Number: CC0402_18PF_50V_5%_C0G; Component Kind: Standard; Component Type: Standard; Pin Count: 2; Value: 18pF; Status: Preferred; Manufacturer Part Number: CC0402_18PF_50V_5%_C0G; Case: 0402; Mounted: Yes; Socket: No; SMD: Yes; Sense: No; Manufacturer1 Example: KEMET; Manufacturer1 ComponentHeight: 0.55mm; HelpURL: \\cern.ch\dfs\Applications\Altium\Datasheets\CC0805_C0G_KEMET_(Commercial Grade).pdf; Author: CERN DEM JLC; CreateDate: 04.10.2016; LatestRevisionDate: 04.10.2016
C77 = CTE3216-18_10UF_16V_20%_AVX_TCJ: Polarised capacitor; Part Description: ESR 0R200 Tantalum Solid Electrolytic Chip Capacitor with Conductive Polymer Electrode; Manufacturer: AVX; Manufacturer Part Number: TCJA106M016R0200; Voltage: 16V; Tolerance: ±20%; Part Number: CTE3216-18_10UF_16V_20%_AVX_TCJ; Component Kind: Standard; Component Type: Standard; Pin Count: 2; Value: 10uF; Status: Preferred; Case: A; Mounted: Yes; Socket: No; SMD: Yes; Sense: No; ComponentHeight: 1.8mm; HelpURL: \\cern.ch\dfs\Applications\Altium\Datasheets\CTE_AVX_TCJ.pdf; Author: CERN DEM JLC; CreateDate: 29.03.2012; LatestRevisionDate: 29.03.2012
C79-C81 C84 C85 C88 = CC0402_100NF_16V_10%_X5R: Non-polarised capacitor; Part Description: SMD Multilayer Chip Ceramic Capacitor; Manufacturer: GENERIC; Manufacturer1 Part Number: GRM155R61C104KA88D; Voltage: 16V; TC: X5R; Tolerance: ±10%; Part Number: CC0402_100NF_16V_10%_X5R; Component Kind: Standard; Component Type: Standard; Pin Count: 2; Value: 100nF; Status: None; Manufacturer Part Number: CC0402_100NF_16V_10%_X5R; Case: 0402; Mounted: Yes; Socket: No; SMD: Yes; Manufacturer1 Example: MURATA; Manufacturer1 ComponentHeight: 0.55mm; HelpURL: \\cern.ch\dfs\Applications\Altium\Datasheets\CC0402_X5R_MURATA_GRM.pdf; Author: CERN DEM JLC; Sense: No
  C79 C80: CreateDate: 10.12.2013; LatestRevisionDate: 10.12.2013
  C81 C84 C85 C88: CreateDate: 10/12/2013; LatestRevisionDate: 10/12/2013
C87 = CC0603_1UF_16V_10%_X7R: Non-polarised capacitor; Part Description: SMD Multilayer Chip Ceramic Capacitor; Manufacturer: GENERIC; Manufacturer1 Part Number: 223878615663; Voltage: 16V; TC: X7R; Tolerance: ±10%; Part Number: CC0603_1UF_16V_10%_X7R; Component Kind: Standard; Component Type: Standard; Pin Count: 2; Value: 1uF; Status: None; Manufacturer Part Number: CC0603_1uF_16V_10%_X7R; Case: 0603; Mounted: Yes; Socket: No; SMD: Yes; Sense: No; Manufacturer1 Example: YAGEO PHYCOMP; Manufacturer1 ComponentHeight: 0.9mm; HelpURL: \\cern.ch\dfs\Applications\Altium\Datasheets\CC0603_X7R_PHYCOMP.pdf; Author: CERN DEM JLC; CreateDate: 03/12/2007; LatestRevisionDate: 17/04/2015
C100 = CC0402_1NF_50V_10%_X7R: Non-polarised capacitor; Part Description: SMD Multilayer Chip Ceramic Capacitor; Manufacturer: GENERIC; Manufacturer1 Part Number: 223858715623; Voltage: 50V; TC: X7R; Tolerance: ±10%; Part Number: CC0402_1NF_50V_10%_X7R; Component Kind: Standard; Component Type: Standard; Pin Count: 2; Value: 1nF; Status: Not Recommended; Manufacturer Part Number: CC0402_1NF_50V_10%_X7R; Case: 0402; Mounted: Yes; Socket: No; SMD: Yes; Sense: No; Manufacturer1 Example: PHYCOMP; Manufacturer1 ComponentHeight: 0.55mm; HelpURL: \\cern.ch\dfs\Applications\Altium\Datasheets\CC0402_X7R_PHYCOMP.pdf; Author: CERN DEM JLC; CreateDate: 03/12/2007; LatestRevisionDate: 03/12/2007
C102 C103 = CC0805_NO-VALUE: Non-polarised capacitor; Part Description: Reserved Footprint For 0805(2012) Chip Ceramic Capacitor; Mounted: No; Part Number: CC0805_NO-VALUE; Component Kind: Standard; Component Type: Standard; Pin Count: 2; Value: Undefined; Status: None; Manufacturer: Undefined; Manufacturer Part Number: CC0805_NO-VALUE; Case: 0805; Socket: No; SMD: Yes; Sense: No; Manufacturer1 ComponentHeight: 1.35mm; HelpURL: Undefined; Author: CERN DEM JLC; CreateDate: 10.12.2008; LatestRevisionDate: 11.09.2013
D4 = D_TVS_DRTR5V0U4S-7: Integrated Quad Ultra-Low Capacitance ESD Protection; Part Description: Integrated Quad Ultra-Low Capacitance ESD (±8kV) Protection; Manufacturer: DIODES; PressFit: No; Bonding: No; Status Comment: Active; Part Number: DRTR5V0U4S-7; Component Kind: Standard; Component Type: Standard; Device: DRTR5V0U4S-7; PackageDescription: SOT363, SC70-6, 0.65mm Pitch; 6 Pin, 1.25mm W X 2.00mm L X 1.10mm H body, IPC Medium Density; Status: Active; Manufacturer Part Number: DRTR5V0U4S-7; Pin Count: 6; Case: SOT363; Mounted: Yes; Socket: No; SMD: Yes; Sense: No; ComponentHeight: 1.1mm; HelpURL: \\cern.ch\dfs\Applications\Altium\Datasheets\PRTR5V0U4Y.pdf; Author: GK; CreateDate: 24.01.2017; LatestRevisionDate: 14.09.2020
D6-D11 D22 D23 = PMEG6020ER: Schottky Diode; Part Description: MEGA Schottky Barrier Rectifier; Manufacturer: NXP SEMICONDUCTORS; Voltage: 60V; Power: 2A; PressFit: No; Bonding: No; Part Number: PMEG6020ER; Component Kind: Standard; Component Type: Standard; Device: PMEG6020ER; PackageDescription: SODFL Diode (SOD123W); 2.60mm W X 1.70mm L X 1.10mm H body, IPC Medium Density; Manufacturer Part Number: PMEG6020ER; Pin Count: 2; Case: SOD123; Mounted: Yes; Socket: No; SMD: Yes; Sense: No; ComponentHeight: 0.65mm; HelpURL: \\cern.ch\dfs\Applications\Altium\Datasheets\PMEG6020ER.pdf; Author: CERN DEM JMW; CreateDate: 19.06.2014; LatestRevisionDate: 19.06.2014
IC11 = IFC_LAN8742A: LAN8742A-CZ-TR - Small Footprint RMII 10/100 Ethernet, Transceiver with HP Auto-MDIX and flexPWR Technology SQFN-24; Manuf_1: MICROCHIP; Order: LAN8742A-CZ-TR; Manuf_Part_1: LAN8742A-CZ-TR; Distrib: MICROCHIP
J10 = CON_ETH_POE_ARJM11C7: MagJack 10/100BaseT, PoE+, 1X1, OG/Y, -40 to 85*C, Tab Up, RoHS; Part Number: 5-2337992-3; Part Description: 1 Port, Orange Green/Yellow LEDs, RJ45 10/100BaseT, PoE, Ethernet MagJack® Connector Module; Manufacturer: TE; PressFit: No; Component Kind: Standard; Component Type: Standard; Pin Count: 18; Family: RJ45; Mounted: Yes; Socket: No; SMD: No; Sense: No; Status: None; Manufacturer Part Number: 5-2337992-3; ComponentHeight: 13.61mm; HelpURL: \\cern.ch\dfs\Applications\Altium\Datasheets\BELFUSE_0826-1X1T-GJ-F.pdf; Author: GK; CreateDate: 05.11.2012; LatestRevisionDate: 05.11.2012
J? = CON_ETH_POE_ARJM11C7: MagJack 10/100BaseT, PoE+, 1X1, OG/Y, -40 to 85*C, Tab Up, RoHS; Part Number: ARJM11C7-114-BA-EW2; Part Description: 1 Port, Orange Green/Yellow LEDs, RJ45 10/100BaseT, PoE, Ethernet MagJack® Connector Module; Manufacturer: Abracon; PressFit: No; Component Kind: Standard; Component Type: Standard; Pin Count: 18; Family: RJ45; Mounted: Yes; Socket: No; SMD: No; Sense: No; Status: None; Manufacturer Part Number: ARJM11C7-114-BA-EW2; ComponentHeight: 13.61mm; HelpURL: \\cern.ch\dfs\Applications\Altium\Datasheets\BELFUSE_0826-1X1T-GJ-F.pdf; Author: GK; CreateDate: 05.11.2012; LatestRevisionDate: 05.11.2012
L7 = IND0402_MURATA_BLM15HB221SN1: Part Description: SMD EMIFIL Suppression Chip Ferrite Bead; Manufacturer: MURATA; Power: 250mA; Resistance: 1R; Tolerance: ±25%; Part Number: IND0402_MURATA_BLM15HB221SN1; Component Kind: Standard; Component Type: Standard; Pin Count: 2; Value: 220R@100MHz; Status: None; Manufacturer Part Number: BLM15HB221SN1; Case: 0402; Mounted: Yes; Socket: No; SMD: Yes; Sense: No; ComponentHeight: 0.55mm; HelpURL: \\cern.ch\dfs\Applications\Altium\Datasheets\IND0402_MURATA_BLM15H.pdf; Author: CERN DEM JLC; CreateDate: 23.06.2009; LatestRevisionDate: 25.10.2018
Q2 = XTAL_25MHZ_EPSON_TSX-3225 25.0000MF10Z-AC: Crystal 4 pins 1=XTAL Control 2=GND3=XTAL 4=GND; Part Description: Tolerance ±10 ppm,  Stability:± 10ppm, -20°C to 75°C, 9pF, Surface Mount Quartz Crystal, TX-3225 Series; Manufacturer: EPSON; PressFit: No; Bonding: No; Part Number: XTAL_25MHZ_EPSON_TSX-3225 25.0000MF10Z-AC; Component Kind: Standard; Component Type: Standard; PackageDescription: Crystal TSX-3225 Serie, Corner Concave; 4 pin, 2.50mm L X 3.2mm W X 0.6mm H; Value: 25MHz; Manufacturer Part Number: TSX-3225 25.0000MF10Z-AC; Pin Count: 4; Mounted: Yes; Socket: No; SMD: Yes; Sense: No; ComponentHeight: 0.6mm; HelpURL: \\cern.ch\dfs\Applications\Altium\Datasheets\XTAL_EPSON_TSX-3225.pdf; ComponentLink1URL: \\cern.ch\dfs\Applications\Altium\Datasheets\XTAL_EPSON_TSX-3225_Ordering-Informations.pdf; ComponentLink1Description: Ordering Informations; Author: CERN DEM JLC; CreateDate: 03.04.2012; LatestRevisionDate: 06.10.2016
R11 R17 = R0402_330R_1%_0.0625W_100PPM: Resistor - 1%; Part Description: General Purpose Thick Film Chip Resistor; Manufacturer: GENERIC; Manufacturer1 Part Number: 232270673301L; TC: ±100ppm/°C; PressFit: No; Part Number: R0402_330R_1%_0.0625W_100PPM; Component Kind: Standard; Component Type: Standard; Pin Count: 2; Value: 330; Status: Not Recommended; Power: 0.0625W; Tolerance: ±1%; Manufacturer Part Number: R0402_330R_1%_0.0625W_100PPM; Case: 0402; Mounted: Yes; Sense: No; Socket: No; SMD: Yes; Manufacturer1 Example: YAGEO PHYCOMP; Manufacturer1 ComponentHeight: 0.4mm; HelpURL: \\cern.ch\dfs\Applications\Altium\Datasheets\R0402_Phycomp_RC0402.pdf; Author: CERN DEM JLC; CreateDate: 03.12.2007; LatestRevisionDate: 17.10.2012
R12 R15 R18 R19 = R0402_49R9_1%_0.0625W_100PPM: Resistor - 1%; Part Description: General Purpose Thick Film Chip Resistor; Manufacturer: GENERIC; Manufacturer1 Part Number: 232270674999L or RC0402FR-0749R9L; TC: ±100ppm/°C; Table: Resistors SMD; Part Number: R0402_49R9_1%_0.0625W_100PPM; Component Kind: Standard; Component Type: Standard; Pin Count: 2; Value: 49R9; Status: Not recommended; Power: 0.0625W; Tolerance: ±1%; Manufacturer Part Number: R0402_49R9_1%_0.0625W_100PPM; Case: 0402; Mounted: Yes; Socket: No; SMD: Yes; Manufacturer1 Example: YAGEO PHYCOMP; Manufacturer1 ComponentHeight: 0.4mm; HelpURL: \\cern.ch\dfs\Applications\Altium\Datasheets\R0402_Phycomp_RC0402.pdf; Author: CERN DEM JLC; CreateDate: 2012-10-24; LatestRevisionDate: 2012-10-24
R20-R22 R25 R28 R99 R125 = R0402_10K_1%_0.0625W_100PPM: Resistor - 1%; Part Description: General Purpose Thick Film Chip Resistor; Manufacturer: GENERIC; Manufacturer1 Part Number: 232270671003L; TC: ±100ppm/°C; PressFit: No; Value: 10k; Part Number: R0402_10K_1%_0.0625W_100PPM; Component Kind: Standard; Component Type: Standard; Pin Count: 2; Status: Not Recommended; Power: 0.0625W; Tolerance: ±1%; Manufacturer Part Number: R0402_10K_1%_0.0625W_100PPM; Case: 0402; Mounted: Yes; Sense: No; Socket: No; SMD: Yes; Manufacturer1 Example: YAGEO PHYCOMP; Manufacturer1 ComponentHeight: 0.4mm; HelpURL: \\cern.ch\dfs\Applications\Altium\Datasheets\R0402_Phycomp_RC0402.pdf; Author: CERN DEM JLC; CreateDate: 03/12/2007; LatestRevisionDate: 17/10/2012
R23 R24 R27 R29 R133 R134 R136 R137 = R0402_33R_1%_0.0625W_100PPM: Resistor - 1%; Part Description: General Purpose Thick Film Chip Resistor; Manufacturer: GENERIC; Manufacturer1 Part Number: 232270673309L; TC: ±100ppm/°C; PressFit: No; Part Number: R0402_33R_1%_0.0625W_100PPM; Component Kind: Standard; Component Type: Standard; Pin Count: 2; Value: 33; Status: Not Recommended; Power: 0.0625W; Tolerance: ±1%; Manufacturer Part Number: R0402_33R_1%_0.0625W_100PPM; Case: 0402; Mounted: Yes; Sense: No; Socket: No; SMD: Yes; Manufacturer1 Example: YAGEO PHYCOMP; Manufacturer1 ComponentHeight: 0.4mm; HelpURL: \\cern.ch\dfs\Applications\Altium\Datasheets\R0402_Phycomp_RC0402.pdf; Author: CERN DEM JLC; CreateDate: 03/12/2007; LatestRevisionDate: 17/10/2012
R26 = R0402_12K1_1%_0.0625W_100PPM: Resistor - 1%; Part Description: General Purpose Thick Film Chip Resistor; Manufacturer: GENERIC; Manufacturer1 Part Number: 232270671213L or RC0402FR-0712K1L; TC: ±100ppm/°C; PressFit: No; Part Number: R0402_12K1_1%_0.0625W_100PPM; Component Kind: Standard; Component Type: Standard; Pin Count: 2; Value: 12k1; Status: Not Recommended; Power: 0.0625W; Tolerance: ±1%; Manufacturer Part Number: R0402_12K1_1%_0.0625W_100PPM; Case: 0402; Mounted: Yes; Sense: No; Socket: No; SMD: Yes; Manufacturer1 Example: YAGEO PHYCOMP; Manufacturer1 ComponentHeight: 0.4mm; HelpURL: \\cern.ch\dfs\Applications\Altium\Datasheets\R0402_Phycomp_RC0402.pdf; Author: CERN DEM JLC; CreateDate: 24/10/2012; LatestRevisionDate: 24/10/2012
R98 = R0402_1K5_1%_0.0625W_100PPM: Resistor - 1%; Part Description: General Purpose Thick Film Chip Resistor; Manufacturer: GENERIC; Manufacturer1 Part Number: 232270671502L; TC: ±100ppm/°C; PressFit: No; Part Number: R0402_1K5_1%_0.0625W_100PPM; Component Kind: Standard; Component Type: Standard; Pin Count: 2; Value: 1k5; Status: Not Recommended; Power: 0.0625W; Tolerance: ±1%; Manufacturer Part Number: R0402_1K5_1%_0.0625W_100PPM; Case: 0402; Mounted: Yes; Sense: No; Socket: No; SMD: Yes; Manufacturer1 Example: YAGEO PHYCOMP; Manufacturer1 ComponentHeight: 0.4mm; HelpURL: \\cern.ch\dfs\Applications\Altium\Datasheets\R0402_Phycomp_RC0402.pdf; Author: CERN DEM JLC; CreateDate: 03/12/2007; LatestRevisionDate: 17/10/2012
R135 = R0603_0R_JUMPER: Resistor; Part Description: 1A (0.05R Max DC Resistance) Zero Ohm Jumper; Manufacturer: GENERIC; Manufacturer1 Part Number: NRC06Z0; PressFit: No; Part Number: R0603_0R_JUMPER; Component Kind: Standard; Component Type: Standard; Pin Count: 2; Value: 0; Status: Preferred; Manufacturer Part Number: R0603_0R_JUMPER; Case: 0603; Mounted: Yes; Sense: No; Socket: No; SMD: Yes; Manufacturer1 Example: NIC COMPONENT; Manufacturer1 ComponentHeight: 0.55mm; HelpURL: \\cern.ch\dfs\Applications\Altium\Datasheets\R0603_NIC_NRC.pdf; Author: CERN DEM JLC; CreateDate: 03.12.2007; LatestRevisionDate: 13.03.2008

## Sheet TH8_USB.SchDoc: Thermostat 8CH
size 420 x 297 mm; Author: G.Kasprowicz; CompanyName: WUT ISE; DrawnBy: G.Kasprowicz; Organization: WUT ISE; Address1: PW ISE; Address2: Nowowiejska 15/19 00-665 Warsaw; Address3: gkasprow@gmail.com; DocumentNumber: 9; Revision: 1.0; SheetNumber: 9; SheetTotal: 9; ModifiedBy: -; CheckedDate: -; Title2: USB connector; DivGrp: WUT ISE; Designer: G.Kasprowicz; ModifiedDate: -; ProjectName: Sensor Box
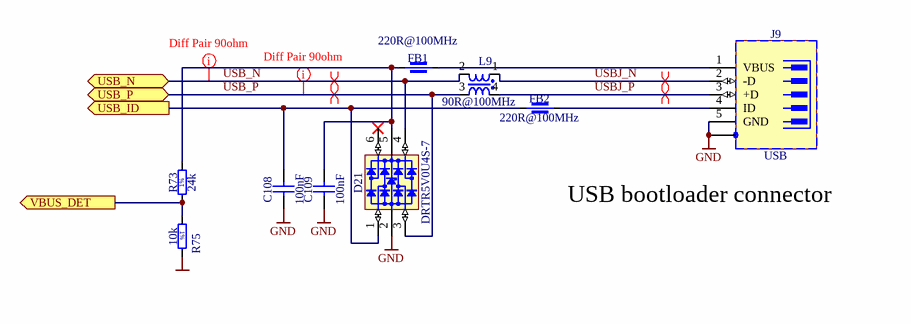
[diagram p5: TH8_USB.SchDoc]

### Parts
C108  100nF  [CAPC1005X55N]
C109  100nF  [CAPC1005X55N]
D21  DRTR5V0U4S-7  [SOT65P210X110-6N]
FB1  220R@100MHz  [INDC1005X55N]
FB2  220R@100MHz  [INDC1005X55N]
J9  USB  [UJ2-MIBH-4-MSMT]
L9  90R@100MHz  [IND_MURATA_DLW21S]
R73  24k  [RESC1608X55N]
R75  10k  [RESC1005X40N]

### Ports
USB_ID (out), USB_N (bidir), USB_P (bidir), VBUS_DET (out)

### Nets
GND: C108.1 C109.1 D21.2(GND) J9.5(GND) J9.6(SH) J9.7(SH) J9.8(SH) J9.9(SH) J9.10(SH) J9.11(SH) R75.2
USB_ID: C108.2 D21.1(I/O1) FB2.1 ; port USB_ID
USB_N: D21.4(I/O3) L9.2 ; port USB_N
USB_P: D21.3(I/O2) L9.3 ; port USB_P
USB_VBUS: R73.1 R75.1 ; port VBUS_DET
USBJ_N: J9.2(-D) L9.1
USBJ_P: J9.3(+D) L9.4
NetC109_2: C109.2 D21.5(VBUS) FB1.1 R73.2
NetFB1_2: FB1.2 J9.1(VBUS)
NetFB2_2: FB2.2 J9.4(ID)

Not connected (* = marked no-connect by the designer): D21 6(I/O4)*

### Layout directives
mark named Diff Pair 90ohm: USB_N, USB_P
differential pair: USB_N, USB_P, USBJ_N, USBJ_P

### Notes on the sheet
- (near J9) USB bootloader connector
- Project/Equipment
- Document
- Designer
- Drawn by
- Check.by
- Copyright WUT ISE 2020.
  This documentation describes Open Hardware and is licensed under the CERN OHL v.1.2. You may redistribute and modify this documentation under the terms of the CERN OHL v.1.2. (http://ohwr.org/CERNOHL). This documentation is distributed WITHOUT ANY EXPRESS OR IMPLIED WARRANTY, INCLUDING OF MERCHANTABILITY, SATISFACTORY QUALITY AND FITNESS FOR A PARTICULAR PURPOSE. Please see the CERN OHL v.1.2 for applicable conditions.
- Contact
- File
- Last Mod.
- Print Date
- Sheet
- Size
- A3
- of
- Rev
- (in symbol R0402_10K_1%_0.0625W_100PPM) 1%
- (in symbol R0603_24K_1%_0.1W_100PPM) 1%

### Library data of the parts
C108 C109 = CC0402_100NF_16V_10%_X7R: Non-polarised capacitor; Part Description: SMD Multilayer Chip Ceramic Capacitor; Manufacturer: GENERIC; Manufacturer1 Part Number: GRM155R71C104KA88D; Voltage: 16V; TC: X7R; Tolerance: ±10%; Part Number: CC0402_100NF_16V_10%_X7R; Component Kind: Standard; Component Type: Standard; Pin Count: 2; Value: 100nF; Status: Not Recommended; Manufacturer Part Number: CC0402_100NF_16V_10%_X7R; Case: 0402; Mounted: Yes; Socket: No; SMD: Yes; Manufacturer1 Example: MURATA; Manufacturer1 ComponentHeight: 0.55mm; HelpURL: \\cern.ch\dfs\Applications\Altium\Datasheets\CC0402_X7R_MURATA_GRM.pdf; Author: CERN DEM JLC; CreateDate: 05.12.2013; LatestRevisionDate: 03.12.2007; Sense: No
D21 = D_TVS_DRTR5V0U4S-7: as D4 on sheet TH8_RMII_Ethernet; Part Number: DRTR5V0U4S-7; Component Kind: Standard; Component Type: Standard; Device: DRTR5V0U4S-7; PackageDescription: SOT363, SC70-6, 0.65mm Pitch; 6 Pin, 1.25mm W X 2.00mm L X 1.10mm H body, IPC Medium Density; Status: Active; Manufacturer Part Number: DRTR5V0U4S-7; Pin Count: 6; Case: SOT363; Mounted: Yes; Socket: No; SMD: Yes; Sense: No; ComponentHeight: 1.1mm; HelpURL: \\cern.ch\dfs\Applications\Altium\Datasheets\PRTR5V0U4Y.pdf; Author: GK; CreateDate: 24.01.2017; LatestRevisionDate: 14.09.2020
FB1 FB2 = IND0402_MURATA_BLM15HB221SN1: as L7 on sheet TH8_RMII_Ethernet; Part Number: IND0402_MURATA_BLM15HB221SN1; Component Kind: Standard; Component Type: Standard; Pin Count: 2; Value: 220R@100MHz; Status: None; Manufacturer Part Number: BLM15HB221SN1; Case: 0402; Mounted: Yes; Socket: No; SMD: Yes; ComponentHeight: 0.55mm; HelpURL: \\cern.ch\dfs\Applications\Altium\Datasheets\IND0402_MURATA_BLM15H.pdf; Author: CERN DEM JLC; CreateDate: 23.06.2009; LatestRevisionDate: 25.10.2018; Sense: No
J9 = CON_USB_UJ2-MIBH-4-MSMT: 5 Pin + 1 Shield  in-line USB Receptacle; Part Number: CUI_UJ2-MIBH-4-MSMT; Part Description: 0.65mm Pitch, Micro-USB Type B Surface Mounte Vertical Receptacle; Manufacturer: CUI; PressFit: No; Component Kind: Standard; Component Type: Standard; Pin Count: 11; Family: USB; Mounted: Yes; Socket: No; SMD: Yes; Sense: No; Status: None; Manufacturer Part Number: UJ2-MIBH-4-MSMT; ComponentHeight: 1.1; HelpURL: \\cern.ch\dfs\Applications\Altium\Datasheets\MOLEX_105133-0011.pdf; Author: GK; CreateDate: 13/12/2017; LatestRevisionDate: 13/12/2017
L9 = IND_MURATA_DLW21SN900SQ2L: Inductor Common Mode; Part Description: Wire Wound Common Mode Choke Coil (DLW21S Series); Manufacturer: MURATA; Power: 330mA; Resistance: 0.35R; Tolerance: ±25%; Part Number: IND_MURATA_DLW21SN900SQ2L; Component Kind: Standard; Component Type: Standard; Pin Count: 4; Value: 90R@100MHz; Status: None; Manufacturer Part Number: DLW21SN900SQ2L; Case: 0805; Mounted: Yes; Socket: No; SMD: Yes; Sense: No; ComponentHeight: 1.4mm; HelpURL: \\cern.ch\dfs\Applications\Altium\Datasheets\IND_MURATA_DLW21S.pdf; Author: CERN DEM JLC; CreateDate: 01.07.2014; LatestRevisionDate: 01.07.2014
R73 = R0603_24K_1%_0.1W_100PPM: Resistor - 1%; Part Description: General Purpose Thick Film Chip Resistor; Manufacturer: GENERIC; Manufacturer1 Part Number: NRC06F2402TRF; Power: 0.1W; TC: ±100ppm/°C; Part Number: R0603_24K_1%_0.1W_100PPM; Component Kind: Standard; Component Type: Standard; Pin Count: 2; Value: 24k; Status: Preferred; Tolerance: ±1%; Manufacturer Part Number: R0603_24K_1%_0.1W_100PPM; Case: 0603; Mounted: Yes; Sense: No; Socket: No; SMD: Yes; Manufacturer1 Example: NIC COMPONENT; Manufacturer1 ComponentHeight: 0.55mm; HelpURL: \\cern.ch\dfs\Applications\Altium\Datasheets\R0603_NIC_NRC.pdf; Author: CERN DEM JLC; CreateDate: 03.12.2007; LatestRevisionDate: 13.03.2008
R75 = R0402_10K_1%_0.0625W_100PPM: as R20-R22 on sheet TH8_RMII_Ethernet; Part Number: R0402_10K_1%_0.0625W_100PPM; Component Kind: Standard; Component Type: Standard; Pin Count: 2; Value: 10k; Status: Not Recommended; Power: 0.0625W; Tolerance: ±1%; Manufacturer Part Number: R0402_10K_1%_0.0625W_100PPM; Case: 0402; Mounted: Yes; Sense: No; Socket: No; SMD: Yes; Manufacturer1 Example: YAGEO PHYCOMP; Manufacturer1 ComponentHeight: 0.4mm; HelpURL: \\cern.ch\dfs\Applications\Altium\Datasheets\R0402_Phycomp_RC0402.pdf; Author: CERN DEM JLC; CreateDate: 03.12.2007; LatestRevisionDate: 17.10.2012

## Sheet TH8_Supply.schdoc: Thermostat 8CH
size 420 x 297 mm; EDA_Number: ARTIQ; Projet: Thermostat; Author: G.Kasprowicz; CompanyName: WUT ISE; DrawnBy: G.Kasprowicz; Organization: WUT ISE; Address1: PW ISE; Address2: Nowowiejska 15/19 00-665 Warsaw; Address3: gkasprow@gmail.com; DocumentNumber: 5; Revision: 2.0; SheetNumber: 5; SheetTotal: 9; ModifiedBy: -; CheckedDate: -; Title2: Power supply; DivGrp: WUT ISE; Designer: G.Kasprowicz; ModifiedDate: -; ProjectName: Sensor Box
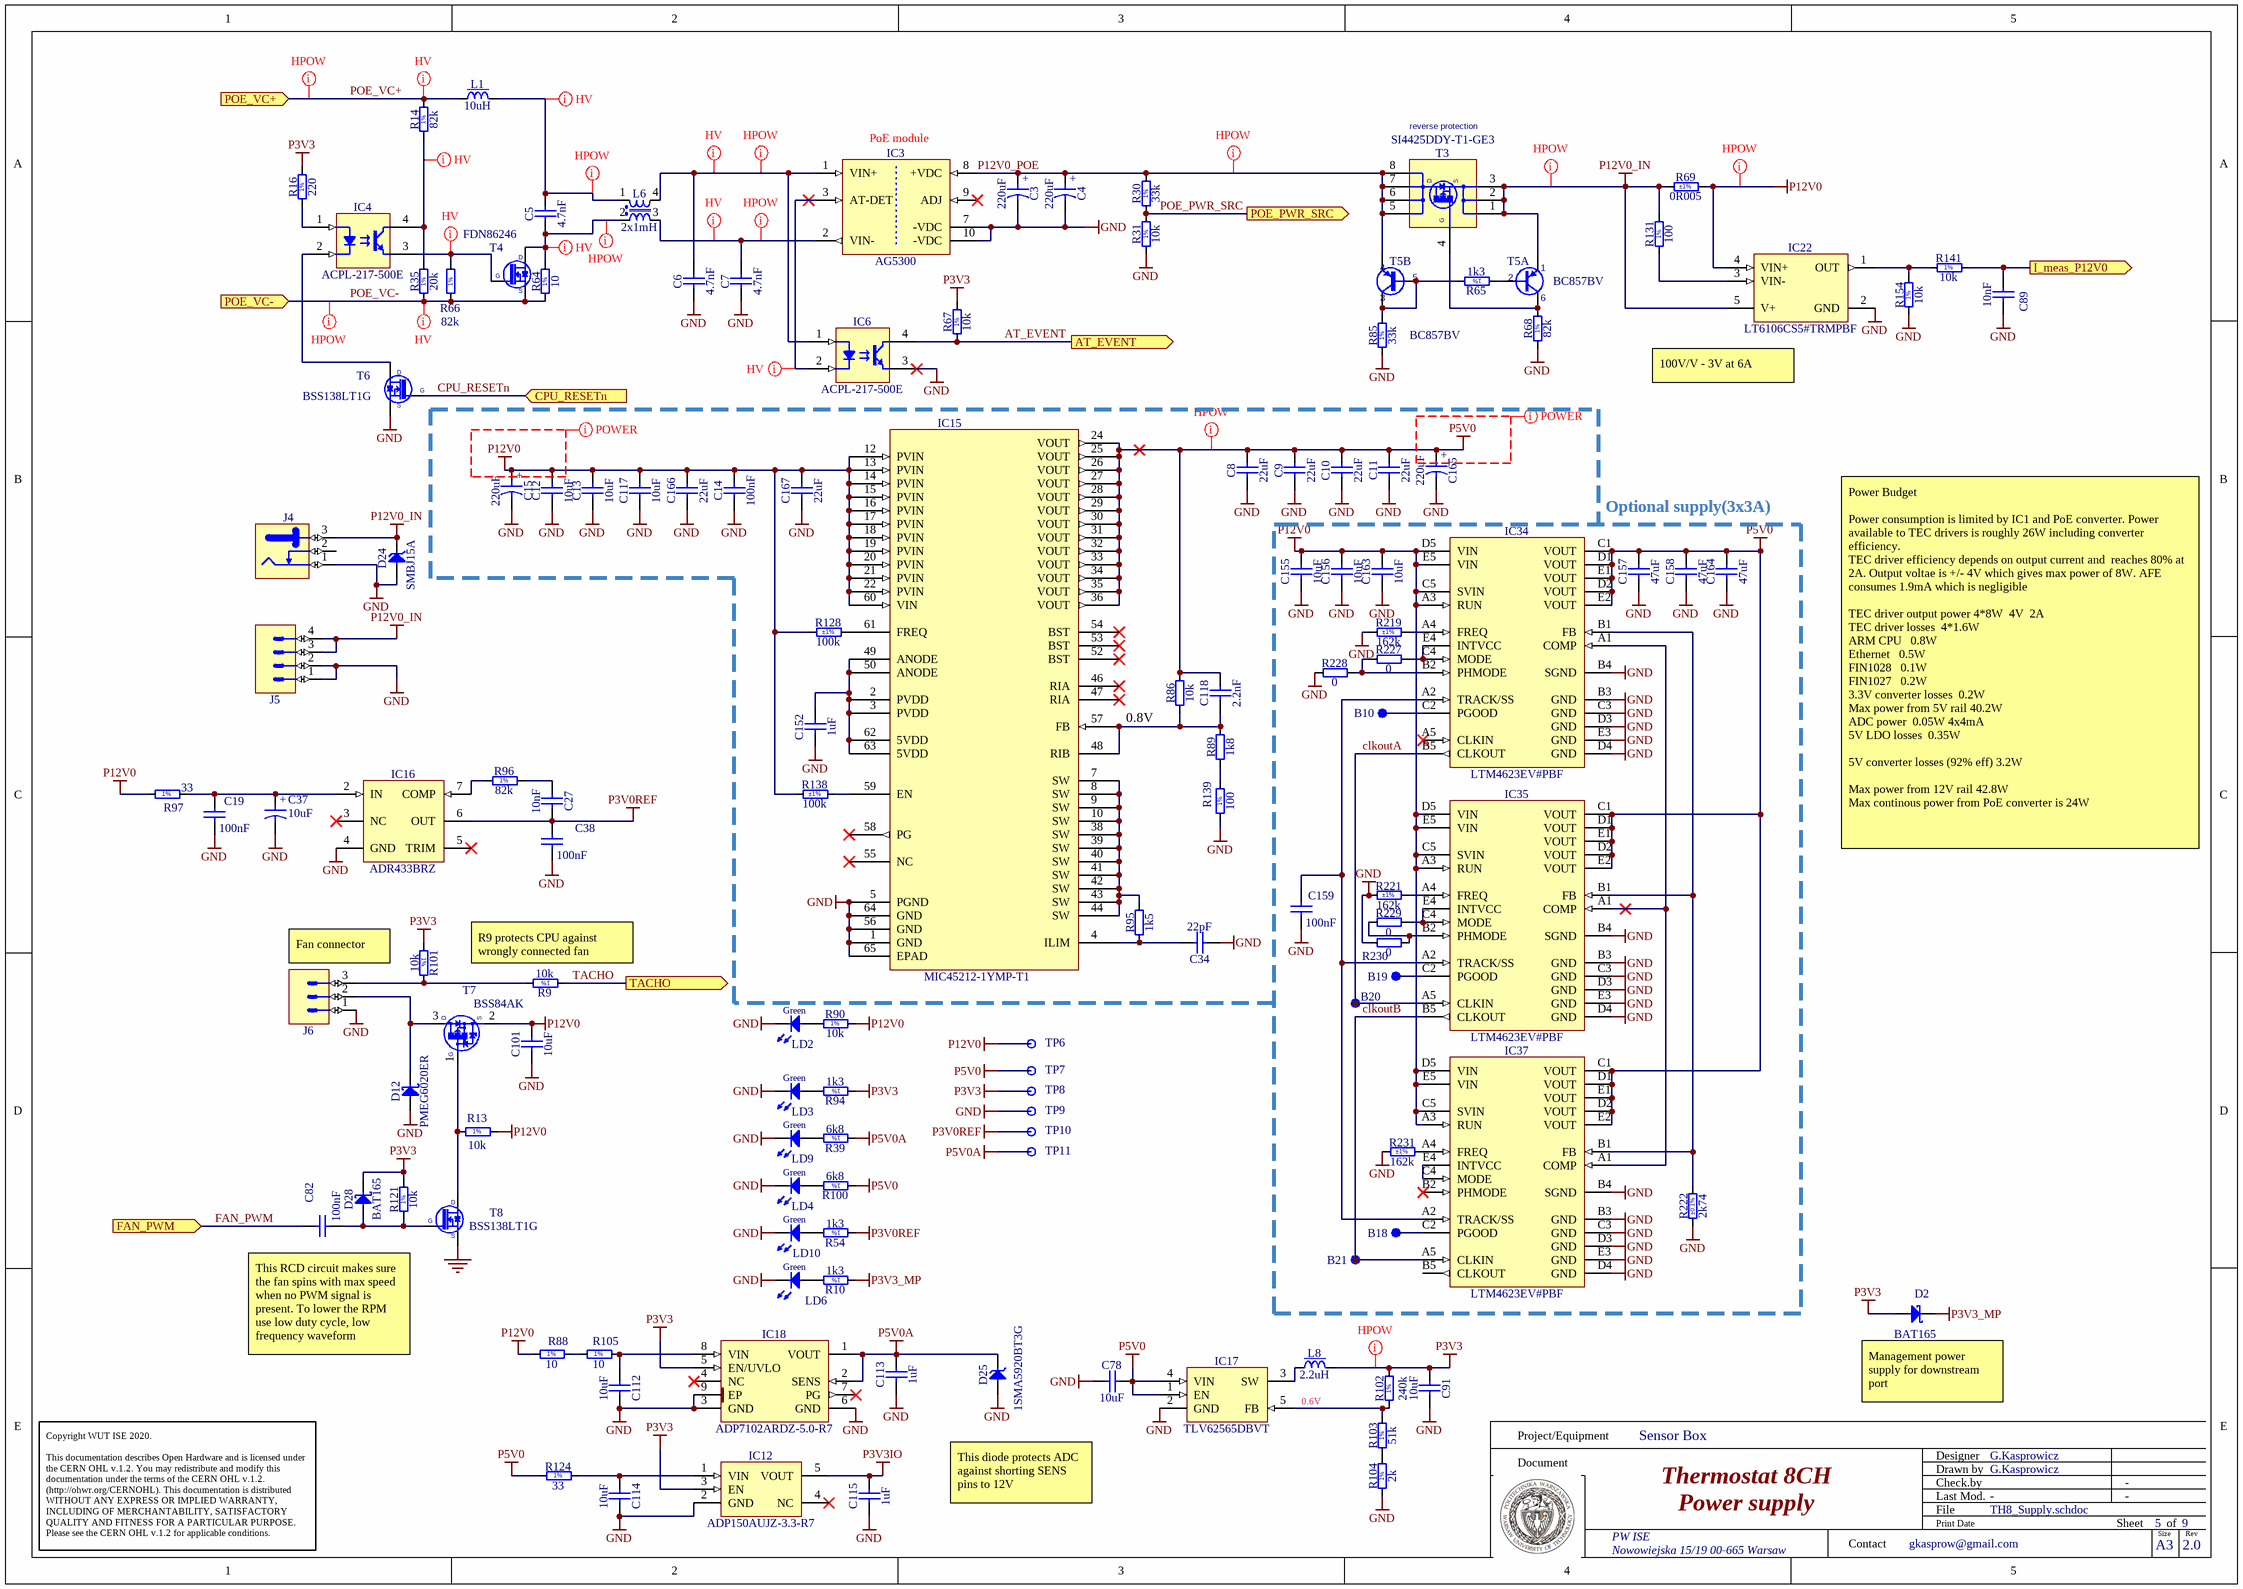
[diagram p6: TH8_Supply.schdoc]